# Altium project Headnode.PrjPcb
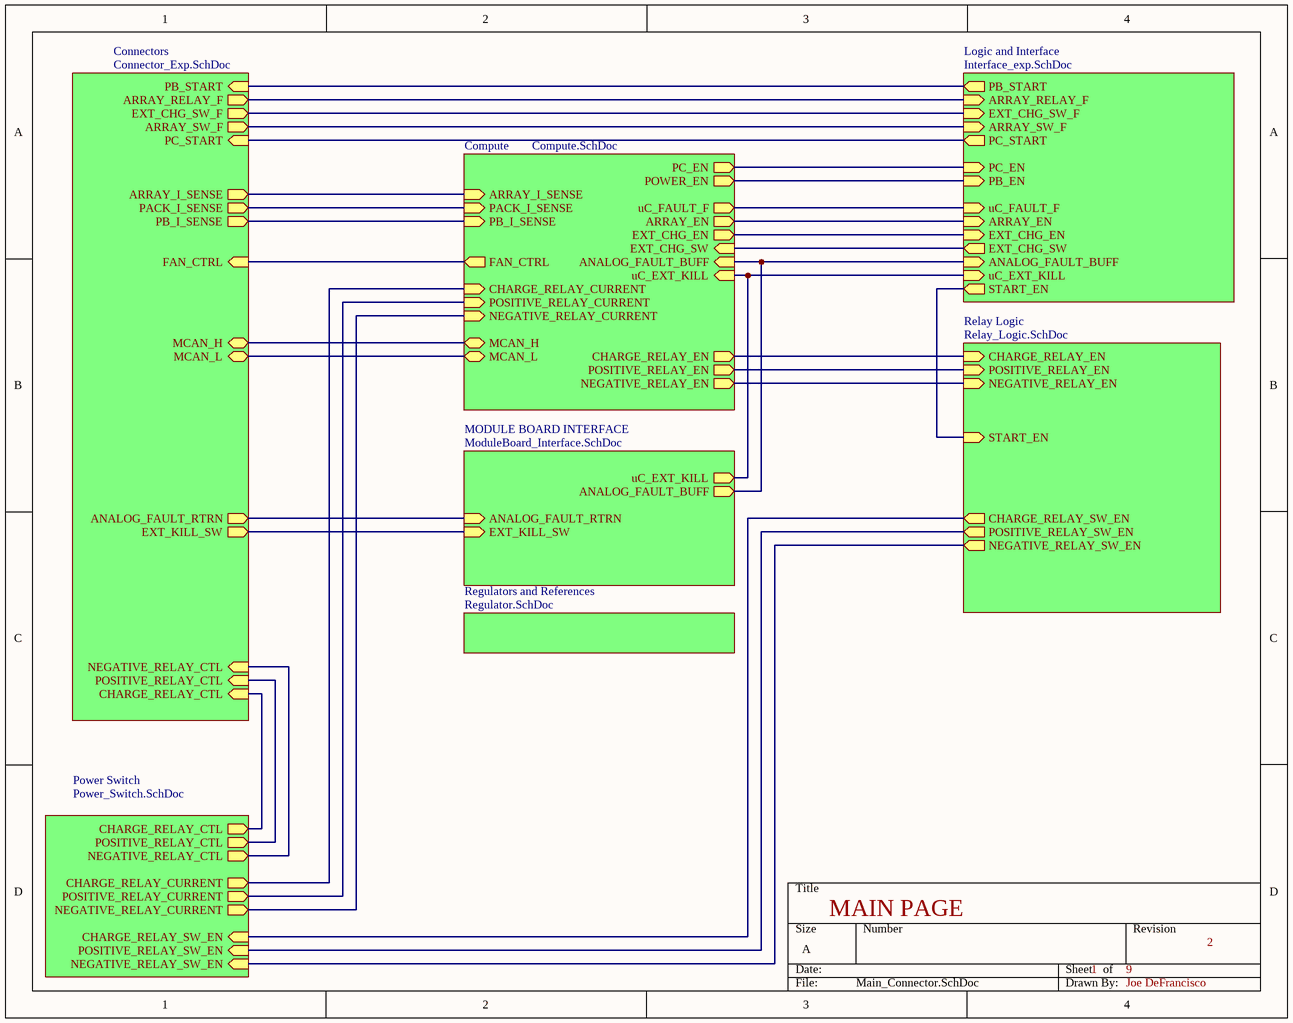
[diagram p0: Main_Connector.SchDoc]
8 sheets, 105 parts. Net scope: hierarchical (ports join the sheet entries above them; power ports are global).
Board file: Headnode.PcbDoc
Sheets:
  Main_Connector.SchDoc
    Compute = Compute.SchDoc
    Connectors = Connector_Exp.SchDoc
    Logic and Interface = Interface_exp.SchDoc
    MODULE BOARD INTERFACE = ModuleBoard_Interface.SchDoc
    Regulators and References = Regulator.SchDoc
    Power Switch = Power_Switch.SchDoc
    Relay Logic = Relay_Logic.SchDoc

## Sheet Main_Connector.SchDoc
size A; SheetNumber: 1; SheetTotal: 6

### Sub-sheets
Compute = Compute.SchDoc: ARRAY_I_SENSE (in), PACK_I_SENSE (in), PB_I_SENSE (in), FAN_CTRL (out), MCAN_H (bidir), MCAN_L (bidir), uC_EXT_KILL (in), EXT_CHG_SW (in), EXT_CHG_EN (out), uC_FAULT_F (out), ARRAY_EN (out), ANALOG_FAULT_BUFF (in), CHARGE_RELAY_EN (out), POSITIVE_RELAY_EN (out), NEGATIVE_RELAY_EN (out), PC_EN (out), POWER_EN (out), NEGATIVE_RELAY_CURRENT (in), POSITIVE_RELAY_CURRENT (in), CHARGE_RELAY_CURRENT (in)
Connectors = Connector_Exp.SchDoc: ARRAY_I_SENSE (out), PACK_I_SENSE (out), ARRAY_SW_F (out), EXT_CHG_SW_F (out), ARRAY_RELAY_F (out), PC_START (in), PB_I_SENSE (out), EXT_KILL_SW (out), ANALOG_FAULT_RTRN (out), MCAN_H (bidir), MCAN_L (bidir), FAN_CTRL (in), CHARGE_RELAY_CTL (in), POSITIVE_RELAY_CTL (in), NEGATIVE_RELAY_CTL (in), PB_START (in)
Logic and Interface = Interface_exp.SchDoc: PC_START (out), ARRAY_SW_F (in), EXT_CHG_SW_F (in), ARRAY_RELAY_F (in), uC_FAULT_F (in), ARRAY_EN (in), EXT_CHG_EN (in), EXT_CHG_SW (out), PC_EN (in), PB_EN (in), PB_START (out), uC_EXT_KILL (in), ANALOG_FAULT_BUFF (in), START_EN (out)
MODULE BOARD INTERFACE = ModuleBoard_Interface.SchDoc: ANALOG_FAULT_RTRN (in), ANALOG_FAULT_BUFF (out), uC_EXT_KILL (out), EXT_KILL_SW (in)
Power Switch = Power_Switch.SchDoc: CHARGE_RELAY_CTL (out), POSITIVE_RELAY_CTL (out), NEGATIVE_RELAY_CTL (out), CHARGE_RELAY_SW_EN (in), POSITIVE_RELAY_SW_EN (in), NEGATIVE_RELAY_SW_EN (in), CHARGE_RELAY_CURRENT (out), POSITIVE_RELAY_CURRENT (out), NEGATIVE_RELAY_CURRENT (out)
Regulators and References = Regulator.SchDoc: no entries
Relay Logic = Relay_Logic.SchDoc: CHARGE_RELAY_EN (in), POSITIVE_RELAY_EN (in), NEGATIVE_RELAY_EN (in), CHARGE_RELAY_SW_EN (out), POSITIVE_RELAY_SW_EN (out), NEGATIVE_RELAY_SW_EN (out), START_EN (in)

### Nets
EXT_CHG_SW: sheet Compute/EXT_CHG_SW, sheet Logic and Interface/EXT_CHG_SW
MCAN_H: sheet Compute/MCAN_H, sheet Connectors/MCAN_H
MCAN_L: sheet Compute/MCAN_L, sheet Connectors/MCAN_L
START_EN: sheet Logic and Interface/START_EN, sheet Relay Logic/START_EN
NetC4_1: sheet Compute/uC_EXT_KILL, sheet Connectors/EXT_KILL_SW, sheet Logic and Interface/uC_EXT_KILL, sheet MODULE BOARD INTERFACE/uC_EXT_KILL, sheet MODULE BOARD INTERFACE/EXT_KILL_SW
NetCH_LG_1: sheet Power Switch/CHARGE_RELAY_SW_EN, sheet Relay Logic/CHARGE_RELAY_SW_EN
NetCH_REL_EN_1: sheet Compute/CHARGE_RELAY_EN, sheet Relay Logic/CHARGE_RELAY_EN
NetD2_2: sheet Connectors/CHARGE_RELAY_CTL, sheet Power Switch/CHARGE_RELAY_CTL
NetD3_2: sheet Connectors/POSITIVE_RELAY_CTL, sheet Power Switch/POSITIVE_RELAY_CTL
NetD4_2: sheet Connectors/NEGATIVE_RELAY_CTL, sheet Power Switch/NEGATIVE_RELAY_CTL
NetJ7_3: sheet Compute/PACK_I_SENSE, sheet Connectors/PACK_I_SENSE
NetJ9_3: sheet Compute/ARRAY_I_SENSE, sheet Connectors/ARRAY_I_SENSE
NetJ10_1: sheet Connectors/PC_START, sheet Logic and Interface/PC_START
NetJ11_1: sheet Compute/PB_I_SENSE, sheet Connectors/PB_I_SENSE
NetJ12_3: sheet Compute/FAN_CTRL, sheet Connectors/FAN_CTRL
NetJ13_1: sheet Connectors/ANALOG_FAULT_RTRN, sheet MODULE BOARD INTERFACE/ANALOG_FAULT_RTRN
NetJ14_1: sheet Connectors/ARRAY_SW_F, sheet Logic and Interface/ARRAY_SW_F
NetJ14_2: sheet Connectors/EXT_CHG_SW_F, sheet Logic and Interface/EXT_CHG_SW_F
NetJ14_3: sheet Connectors/ARRAY_RELAY_F, sheet Logic and Interface/ARRAY_RELAY_F
NetJ17_1: sheet Connectors/PB_START, sheet Logic and Interface/PB_START
NetNEG_LOG_1: sheet Power Switch/NEGATIVE_RELAY_SW_EN, sheet Relay Logic/NEGATIVE_RELAY_SW_EN
NetNEG_REL_EN_1: sheet Compute/NEGATIVE_RELAY_EN, sheet Relay Logic/NEGATIVE_RELAY_EN
NetPOS_LG_1: sheet Power Switch/POSITIVE_RELAY_SW_EN, sheet Relay Logic/POSITIVE_RELAY_SW_EN
NetPOS_REL_EN_1: sheet Compute/POSITIVE_RELAY_EN, sheet Relay Logic/POSITIVE_RELAY_EN
NetQ4_1: sheet Compute/POWER_EN, sheet Logic and Interface/PB_EN
NetQ5_1: sheet Compute/PC_EN, sheet Logic and Interface/PC_EN
NetQ6_2: sheet Compute/ANALOG_FAULT_BUFF, sheet Logic and Interface/ANALOG_FAULT_BUFF, sheet MODULE BOARD INTERFACE/ANALOG_FAULT_BUFF
NetR1_1: sheet Compute/EXT_CHG_EN, sheet Logic and Interface/EXT_CHG_EN
NetR2_1: sheet Compute/ARRAY_EN, sheet Logic and Interface/ARRAY_EN
NetR5_1: sheet Compute/uC_FAULT_F, sheet Logic and Interface/uC_FAULT_F
NetR32_1: sheet Compute/CHARGE_RELAY_CURRENT, sheet Power Switch/CHARGE_RELAY_CURRENT
NetR35_1: sheet Compute/POSITIVE_RELAY_CURRENT, sheet Power Switch/POSITIVE_RELAY_CURRENT
NetR38_1: sheet Compute/NEGATIVE_RELAY_CURRENT, sheet Power Switch/NEGATIVE_RELAY_CURRENT

### Notes on the sheet
- MAIN PAGE
- 1
- 9
- 2
- Joe DeFrancisco

## Sheet Compute.SchDoc: Compute Module Interface
size A4; SheetNumber: 6; SheetTotal: 6; ImagePath: X:\solarcar\P15_BPS\P15_BPS\logo.jpg
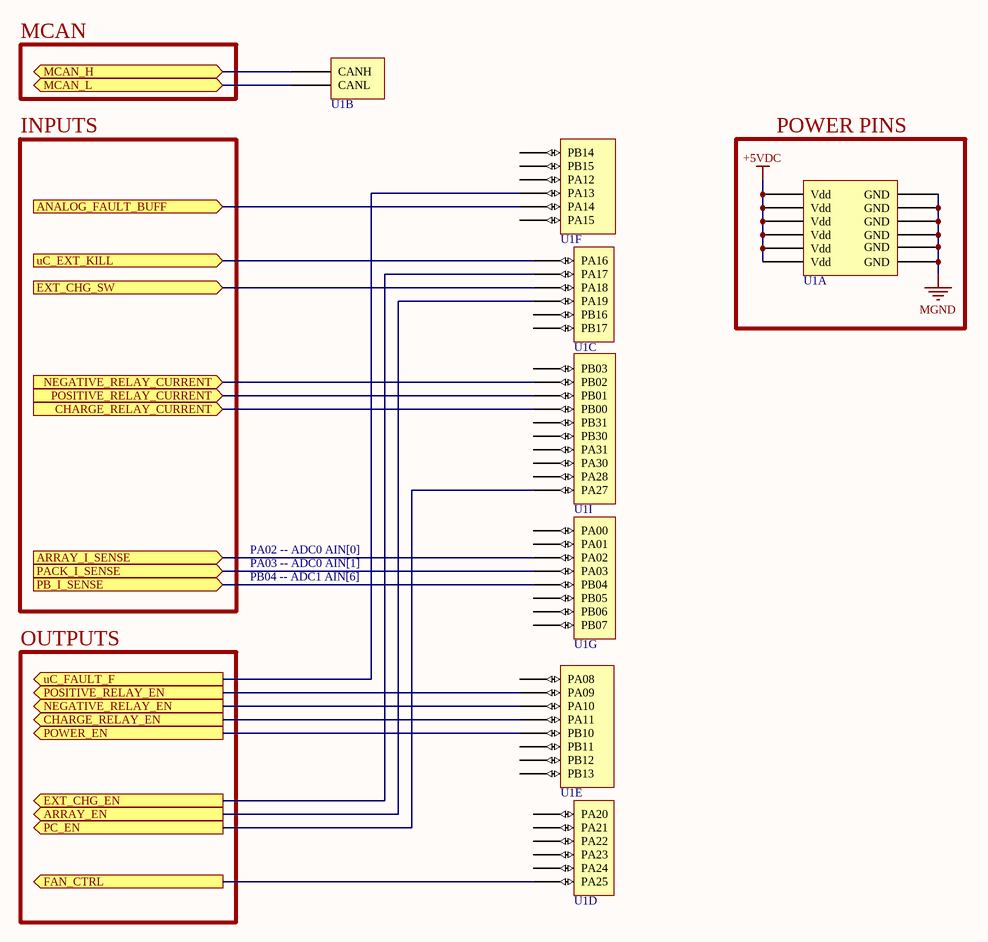
[diagram p1: Compute.SchDoc]

### Parts
U1  S+  [Compute S+]  (value not drawn)  (parts A,B,C,D,E,F,G,I of 9)

### Blocks framed on the sheet
POWER PINS: U1

### Ports
ANALOG_FAULT_BUFF (in), ARRAY_EN (out), ARRAY_I_SENSE (in), CHARGE_RELAY_CURRENT (in), CHARGE_RELAY_EN (out), EXT_CHG_EN (out), EXT_CHG_SW (in), FAN_CTRL (out), MCAN_H (bidir), MCAN_L (bidir), NEGATIVE_RELAY_CURRENT (in), NEGATIVE_RELAY_EN (out), PACK_I_SENSE (in), PB_I_SENSE (in), PC_EN (out), POSITIVE_RELAY_CURRENT (in), POSITIVE_RELAY_EN (out), POWER_EN (out), uC_EXT_KILL (in), uC_FAULT_F (out)

### Nets
+5VDC: U1.Vdd
MGND: U1.GND
EXT_CHG_SW: U1.PA18 ; port EXT_CHG_SW
MCAN_H: U1.CANH ; port MCAN_H
MCAN_L: U1.CANL ; port MCAN_L
NetC4_1: U1.PA16 ; port uC_EXT_KILL
NetCH_REL_EN_1: U1.PA11 ; port CHARGE_RELAY_EN
NetJ7_3: U1.PA03 ; port PACK_I_SENSE
NetJ9_3: U1.PA02 ; port ARRAY_I_SENSE
NetJ11_1: U1.PB04 ; port PB_I_SENSE
NetJ12_3: U1.PA25 ; port FAN_CTRL
NetNEG_REL_EN_1: U1.PA10 ; port NEGATIVE_RELAY_EN
NetPOS_REL_EN_1: U1.PA09 ; port POSITIVE_RELAY_EN
NetQ4_1: U1.PB10 ; port POWER_EN
NetQ5_1: U1.PA27 ; port PC_EN
NetQ6_2: U1.PA14 ; port ANALOG_FAULT_BUFF
NetR1_1: U1.PA17 ; port EXT_CHG_EN
NetR2_1: U1.PA19 ; port ARRAY_EN
NetR5_1: U1.PA13 ; port uC_FAULT_F
NetR32_1: U1.PB00 ; port CHARGE_RELAY_CURRENT
NetR35_1: U1.PB01 ; port POSITIVE_RELAY_CURRENT
NetR38_1: U1.PB02 ; port NEGATIVE_RELAY_CURRENT

Not connected (* = marked no-connect by the designer): U1 PA00 PA01 PA08 PA12 PA20 PA21 PA22 PA23 PA24 PA28 PA30 PA31 PB03 PB05 PB06 PB07 PB09(PA15) PB11 PB12 PB13 PB14 PB15 PB16 PB17 PB30 PB31

### Notes on the sheet
- MCAN
- INPUTS
- PA02 -- ADC0 AIN[0]
- PA03 -- ADC0 AIN[1]
- PB04 -- ADC1 AIN[6]
- OUTPUTS
- Title
- Size:
- Date:
- A4
- Number:
- Time:
- Revision:
- Sheet
- of
- File:

### Library data of the parts
U1 = S+: Need to get 4 of PPPC161LFBN-RC; Digi-key: https://www.digikey.com/product-detail/en/sullins-connector-solutions/PPPC161LFBN-RC/S7049-ND/810188; datasheet: https://media.digikey.com/pdf/Data%20Sheets/Sullins%20PDFs/Female_Headers.100_DS.pdf

## Sheet Connector_Exp.SchDoc: Connectors
size A3; Organization: PRISUM; Revision: 2; SheetNumber: 2; SheetTotal: 6
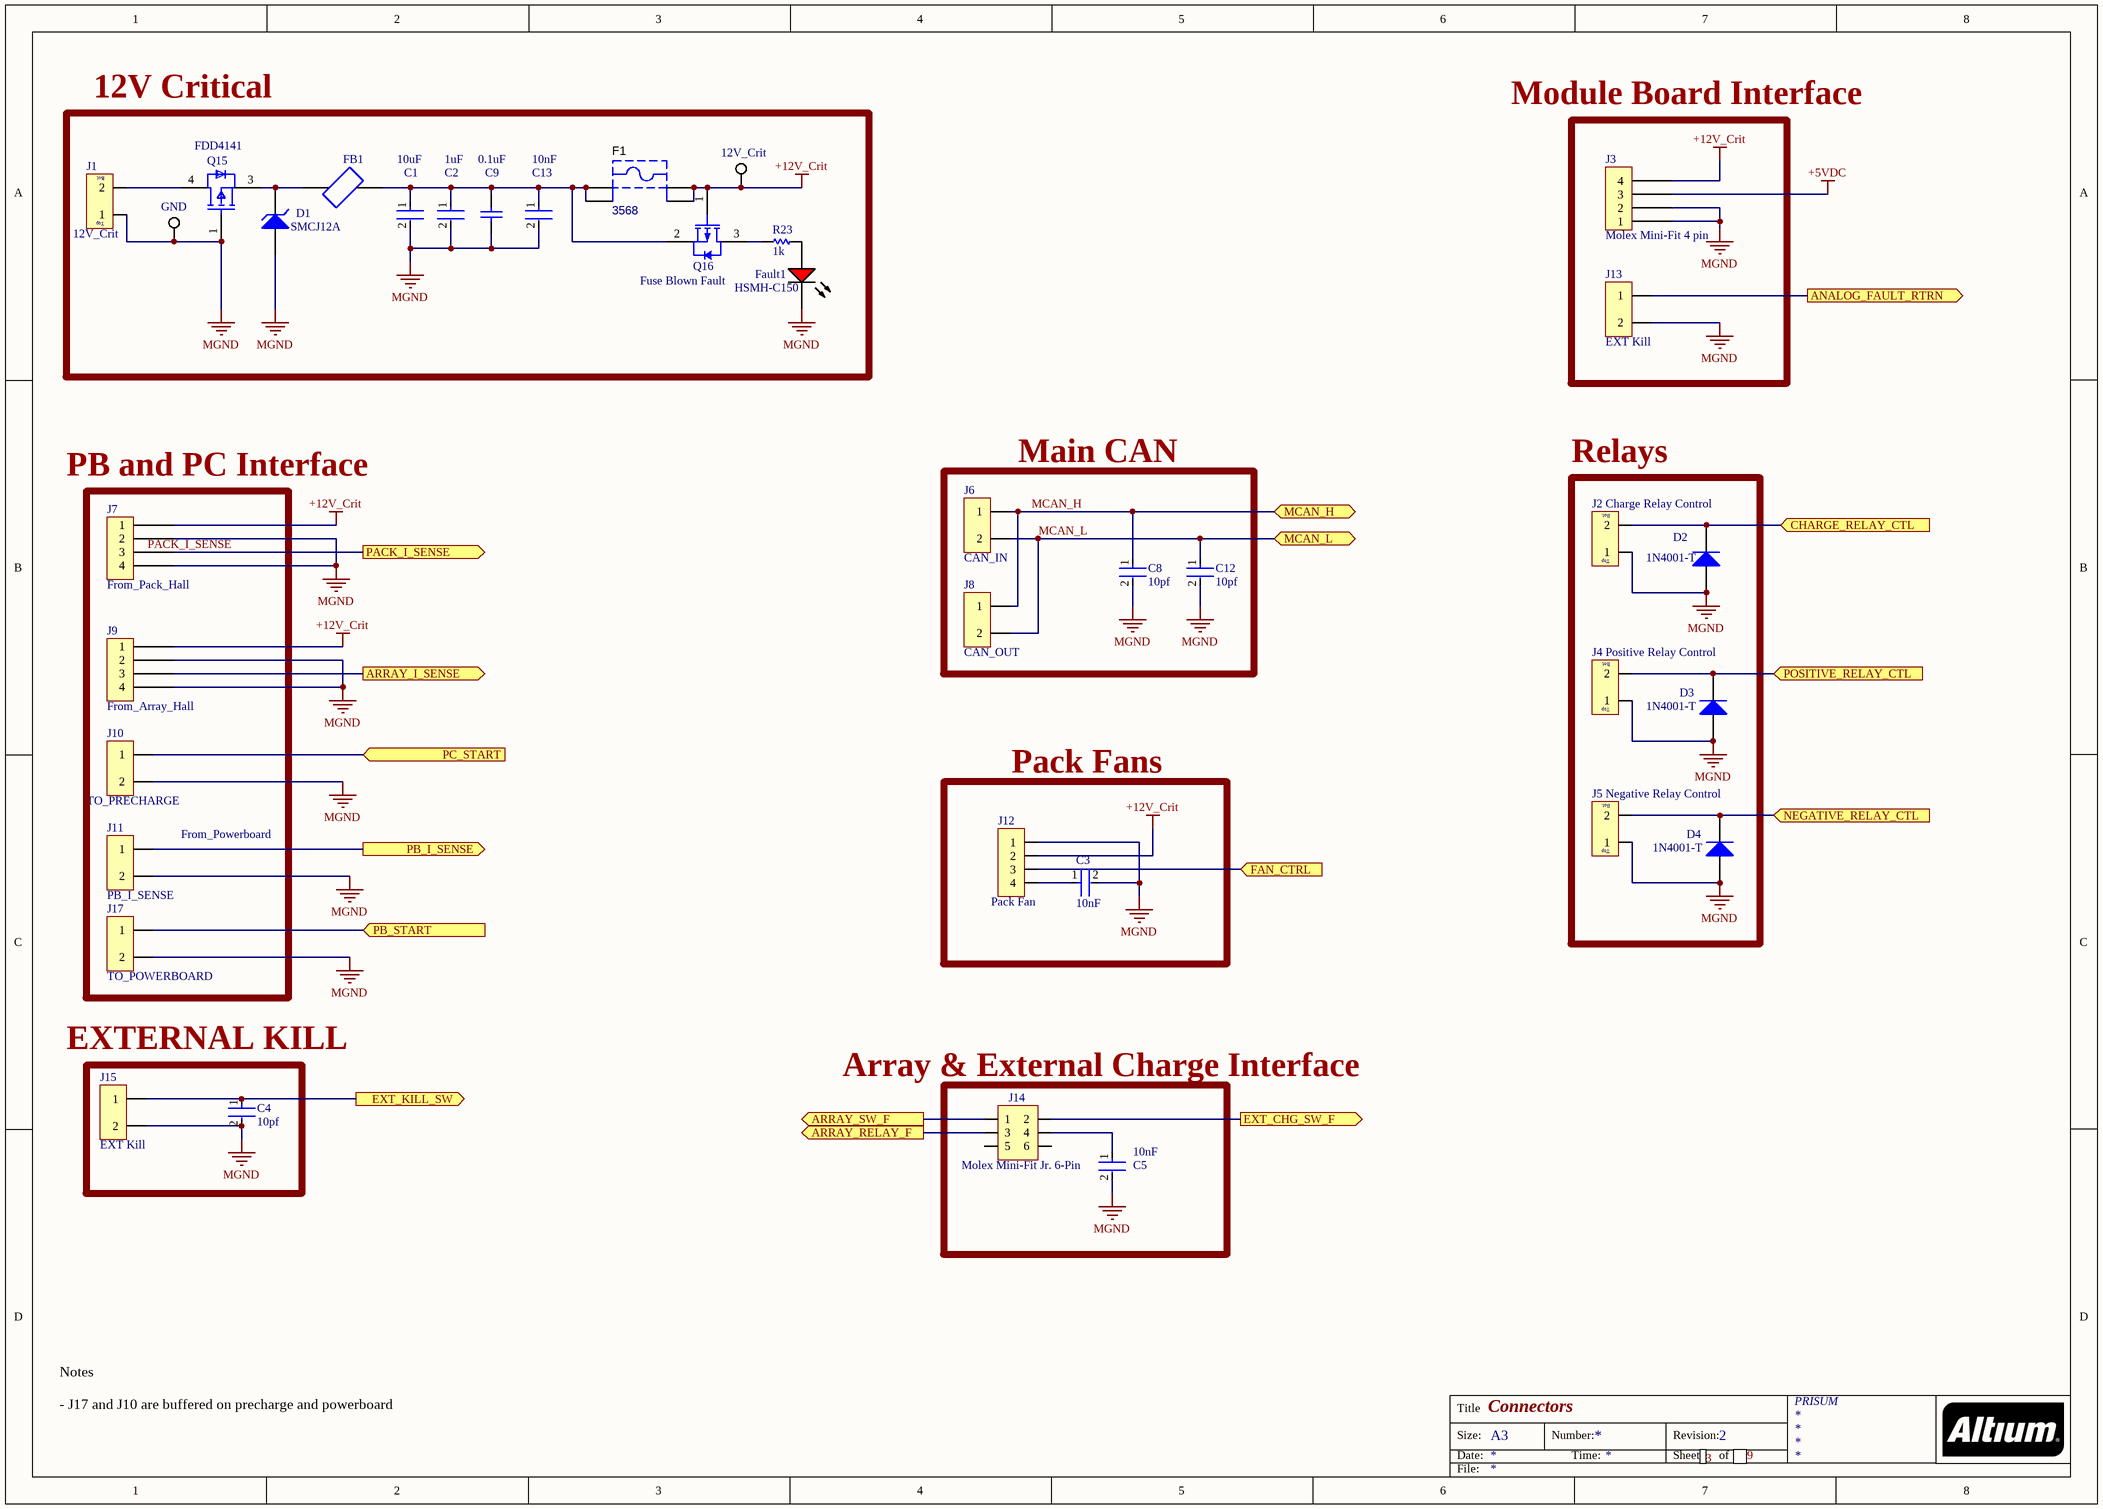
[diagram p2: Connector_Exp.SchDoc]

### Parts
12V_Crit  Test Point  [Test Point]  (value not drawn)
C1  Capacitance: 10uF  [FP-CL31-IPC_A]  (hidden comment: CL31A106MOHNNNE)
C2  Capacitance: 1uF  [FP-CL31-IPC_A]  (hidden comment: CL31F105ZOCNNNC)
C3  Capacitance: 10nF  [FP-CGA3E-0_3-0_1-IPC_A]  (hidden comment: CGA3E2X8R2A103K080AD)
C4  10pf  [FP-C0805C-DN-MFG]
C5  Capacitance: 10nF  [FP-CGA3E-0_3-0_1-IPC_A]  (hidden comment: CGA3E2X8R2A103K080AD)
C8  10pf  [FP-C0805C-DN-MFG]
C9  Capacitance: 0.1uF  [CAPC2013X94X50LL20T25]  (hidden comment: 08055C104JAT2A)
C12  10pf  [FP-C0805C-DN-MFG]
C13  Capacitance: 10nF  [FP-CGA3E-0_3-0_1-IPC_A]  (hidden comment: CGA3E2X8R2A103K080AD)
D1  SMCJ12A  [LFUS-DO-214AB-2_V]
D2  1N4001-T  [DIOD-DO-41-P-2_V]
D3  1N4001-T  [DIOD-DO-41-P-2_V]
D4  1N4001-T  [DIOD-DO-41-P-2_V]
F1  3568  [KSTN-3568_V]
Fault1  HSMH-C150  [AVAG-HSMX-C150_V]
FB1  HI1206N800R-10  [FB_HI1206N800R-10]  (value not drawn)
GND  Test Point  [Test Point]  (value not drawn)
J1  12V_Crit  [CONN_2P_MEGAFIT_HORIZONTAL]
J2  Charge Relay Control  [CONN_2P_MEGAFIT_HORIZONTAL]
J3  Molex Mini-Fit 4 pin  [Molex Mini-Fit Jr. 4-Pin - no flange]
J4  Positive Relay Control  [CONN_2P_MEGAFIT_HORIZONTAL]
J5  Negative Relay Control  [CONN_2P_MEGAFIT_HORIZONTAL]
J6  CAN_IN  [Mini-Fit Jr. 2]
J7  From_Pack_Hall  [Molex Mini-Fit Jr. 4-Pin - no flange]
J8  CAN_OUT  [Mini-Fit Jr. 2]
J9  From_Array_Hall  [Molex Mini-Fit Jr. 4-Pin - no flange]
J10  TO_PRECHARGE  [Mini-Fit Jr. 2]
J11  PB_I_SENSE  [Mini-Fit Jr. 2]
J12  Molex Mini-Fit Jr. 4-Pin no flange  [Molex Mini-Fit Jr. 4-Pin - no flange]  (value not drawn)
J13  EXT Kill  [Mini-Fit Jr. 2]
J14  Molex Mini-Fit Jr. 6-Pin  [Molex Mini-Fit Jr. 6-Pin]
J15  EXT Kill  [Mini-Fit Jr. 2]
J17  TO_POWERBOARD  [Mini-Fit Jr. 2]
Q15  FDD4141  [FP-369AS-MFG]
Q16  Fuse Blown Fault  [INTR-SOT-23-3_V]
R23  SchematicInformation: 1k  [R_0603]  (hidden comment: RES_1k_1%_0603)

### Blocks framed on the sheet
12V Critical: 12V_Crit C1 C2 C9 C13 D1 F1 Fault1 FB1 GND J1 Q15 Q16 R23
From_Powerboard: J7 J9-J11 J17
Main CAN: C8 C12 J6 J8
Relays: D2-D4 J2 J4 J5
Pack Fans: C3 J12

### Ports
ANALOG_FAULT_RTRN (out), ARRAY_I_SENSE (out), ARRAY_RELAY_F (out), ARRAY_SW_F (out), CHARGE_RELAY_CTL (in), EXT_CHG_SW_F (out), EXT_KILL_SW (out), FAN_CTRL (in), MCAN_H (bidir), MCAN_L (bidir), NEGATIVE_RELAY_CTL (in), PACK_I_SENSE (out), PB_I_SENSE (out), PB_START (in), PC_START (in), POSITIVE_RELAY_CTL (in)

### Nets
+5VDC: J3.3
+12V_Crit: 12V_Crit.1 F1.3 F1.4 J3.4 J7.1 J9.1 J12.2 Q16.1(GATE)
MGND: C1.2 C2.2 C3.2 C4.2 C5.2 C8.2 C9.1 C12.2 C13.2 D1.1(A) D2.1(A) D3.1(A) D4.1(A) Fault1.2(K) GND.1 J1.1 J2.1 J3.1 J3.2 J4.1 J5.1 J7.2 J7.4 J9.2 J9.4 J10.2 J11.2 J12.1 J13.2 J15.2 J17.2 Q15.1(G)
MCAN_H: C8.1 J6.1 J8.1 ; port MCAN_H
MCAN_L: C12.1 J6.2 J8.2 ; port MCAN_L
NetC1_1: C1.1 C2.1 C9.2 C13.1 F1.1 F1.2 FB1.2 Q16.2(SOURCE)
NetC3_1: C3.1 J12.4
NetC4_1: C4.1 J15.1 ; port EXT_KILL_SW
NetC5_1: C5.1 J14.4
NetD1_2: D1.2(K) FB1.1 Q15.3(S)
NetD2_2: D2.2(K) J2.2 ; port CHARGE_RELAY_CTL
NetD3_2: D3.2(K) J4.2 ; port POSITIVE_RELAY_CTL
NetD4_2: D4.2(K) J5.2 ; port NEGATIVE_RELAY_CTL
NetFault1_1: Fault1.1(A) R23.2
NetJ1_2: J1.2 Q15.4(D)
NetJ7_3: J7.3 ; port PACK_I_SENSE
NetJ9_3: J9.3 ; port ARRAY_I_SENSE
NetJ10_1: J10.1 ; port PC_START
NetJ11_1: J11.1 ; port PB_I_SENSE
NetJ12_3: J12.3 ; port FAN_CTRL
NetJ13_1: J13.1 ; port ANALOG_FAULT_RTRN
NetJ14_1: J14.1 ; port ARRAY_SW_F
NetJ14_2: J14.2 ; port EXT_CHG_SW_F
NetJ14_3: J14.3 ; port ARRAY_RELAY_F
NetJ17_1: J17.1 ; port PB_START
NetQ16_3: Q16.3(DRAIN) R23.1

Not connected (* = marked no-connect by the designer): J14 5 6

### Notes on the sheet
- Module Board Interface
- (near J7) PB and PC Interface
- (near J12) Pack Fan
- EXTERNAL KILL
- (near J14) Array & External Charge Interface
- Notes
  - J17 and J10 are buffered on precharge and powerboard
- 3
- 9
- Labels drawn without touching a wire or pin: PACK_I_SENSE
- Title
- Size:
- Date:
- A3
- Number:
- Time:
- Revision:
- Sheet
- of
- File:
- (in symbol CONN_2P_MEGAFIT_HORIZONTAL) Bot.; Top

### Library data of the parts
C1 = CMP-13271-002453-1: Cap Ceramic 10uF 16V X5R ±20% SMD 1206 +85°C Embossed T/R; Thickness: 0.071inch; Case Code (Imperial): 1206; Case Code (Metric): 3216; Height: 1.6mm; Max Operating Temperature: 85°C; Voltage Rating: 16V; Package Quantity: 1; Length: 3.2mm; Dielectric: X5R; Voltage Rating (DC): 16V; Tolerance: 20%; Case/Package: 1206; Depth: 1.6mm; Mount: Surface Mount; Radiation Hardening: No; Width: 0.063inch; Lead Free: Lead Free; Min Operating Temperature: -55°C; Packaging: Tape and Reel
C2 = CMP-13271-003959-1: Cap Ceramic 1uF 16V Y5V -20/+80% SMD 1206 +85°C Embossed T/R; Tolerance: 80%; Length: 3.2mm; Package Quantity: 4000; Lead Free: Lead Free; Height: 0.85mm; Packaging: Tape and Reel; Max Operating Temperature: 85°C; Case Code (Imperial): 1206; Case/Package: 1206; Dielectric: Y5V; Min Operating Temperature: -30°C; Voltage Rating (DC): 16V; Width: 0.063inch; Mount: Surface Mount; Voltage Rating: 16V; Depth: 1.6mm; Thickness: 0.039inch; Radiation Hardening: No; Case Code (Metric): 3216
C3 C5 C13 = CMP-08246-000769-1: Cap Ceramic 10nF 100V X8R 10% Pad SMD 0603 +150°C Automotive T/R; Mount: Surface Mount; Voltage Rating (DC): 100V; Termination: SMD/SMT; Dielectric: X8R; Case/Package: 0603; Ratings: AEC-Q200; Voltage Rating: 100V; Packaging: Tape and Reel; Thickness: 0.035inch; Composition: Ceramic; Max Operating Temperature: 150°C; Width: 0.031inch; Height: 0.8mm; Weight: 7.1E-05oz; Depth: 0.8mm; Min Operating Temperature: -55°C; Length: 1.6mm; Case Code (Metric): 1608; Tolerance: 10%; Package Quantity: 4000; Case Code (Imperial): 0603
C4 C8 C12 = CMP-03020-001866-1: C0805 10 pF C0G 30ppm/°C 2.00% 50 V; Manufacturer Part Number: C0805C100G5GACTU; Manufacturer: KEMET; Tolerance: 0.02; Voltage Rating: 50 V; Material: Ceramic; Device Class L1: Passive Components; Category: Cap; Temperature: -55°C to +125°C; Height: 0.88mm; Ipc Land Pattern Name: CAPC200125X78; ComponentLink2URL: https://content.kemet.com/datasheets/KEM_C1003_C0G_SMD.pdf; Capacitance: 10 pF; Octopart: https://octopart.com/c0805c100g5gactu-kemet-20071675; Device Class L2: Capacitors; Device Class L3: Ceramic Capacitors; Temperature Range Low: -55°C; RoHS: TRUE; Temperature Range High: +125°C; Temperature Characteristic: C0G; Value: 10 pF; Mouser Description: Multilayer Ceramic Capacitors MLCC - SMD/SMT 50volts 10pF C0G 2%; ComponentLink2Description: Datasheet; Package: C0805C-DN; Lead Free: Yes; Automotive: No; Temperature Coefficient: 30ppm/°C
C9 = CMP-2000-05808-1: Chip Capacitor, 0.1 uF, +/- 5%, 50 V, -55 to 125 degC, 0805 (2012 Metric), RoHS, Tape and Reel; Case Width: 1.25mm; Case Length: 2.01mm; Case Height: 0.94mm; Brand: AVX; Type: StandardX7RMLCCs; Capacitance - nF: 100nF; Dissipation Factor DF: 2.5; Voltage Rating DC: 50V; Temperature Coefficient / Code: +/-15%; Capacitance - pF: 100000pF; Dielectric: X7R; Dimensions: 1.25mmWx2.01mmLx0.94mmH; Product: GeneralTypeMLCCs; Package Description: 2-Pin Surface Mount Device, Body 2.01 x 1.25 mm; Package / Case: 0805(2012metric); Product Category: MultilayerCeramicCapacitorsMLCC-SMD/SMT; Case Code - mm: 2012; Packaging: Reel; Manufacturer URL: http://www.avx.com/; Operating Temperature Range: -55Cto+125C; Termination Style: SMD/SMT; Maximum Operating Temperature: +125C; Case Code - in: 0805; Minimum Operating Temperature: -55C; Factory Pack Quantity: 4000; RoHS: Details; Voltage Rating: 50V; Tolerance: 5%; Package Reference: 0805; Datasheet URL: http://www.farnell.com/datasheets/1679506.pdf; Manufacturer: AVX; Mounting Technology: SurfaceMount; Datasheet Version: 11/2012
D1 = CMP-2000-07101-1: Transient Voltage Suppression Diode, 12 V, -65 to 150 degC, 2-Pin DO-214AB (SMCJ), RoHS, Tape and Reel; Manufacturer: Littelfuse; Directional: Uni-Directional; Breakdown Voltage-Max: 14.7V; Clamping Voltage-Max: 19.9V; Breakdown Voltage-Min: 13.3V; Power Dissipation: 1500W; Manufacturer URL: http://www.littelfuse.com/; Datasheet Version: 11/2015; Package Description: 2-Pin Surface Mount Device, Body 6.855 x 5.905 mm; Package Reference: DO-214AB; Mounting Technology: SurfaceMount; Datasheet URL: http://www.littelfuse.com/products/tvs-diodes/surface-mount/~/media/electronics/datasheets/tvs_diodes/littelfuse_tvs_diode_smcj_datasheet.pdf.pdf; ComponentLink1Description: Datasheet; ComponentLink1URL: https://www.littelfuse.com/products/tvs-diodes/surface-mount/~/media/electronics/datasheets/tvs_diodes/littelfuse_tvs_diode_smcj_datasheet.pdf.pdf; ComponentLink2Description: Digikey; ComponentLink2URL: https://www.digikey.com/product-detail/en/SMCJ12A/SMCJ12ALFCT-ND/762588?utm_campaign=buynow&WT.z_cid=ref_octopart_dkc_buynow&utm_medium=aggregator&curr=usd&site=us&utm_source=octopart
D2-D4 = CMP-0639-00006-2: 1.0 A Rectifier, 15 pF, 50 V, -65 to 150 degC, 2-Pin DO-41 Plastic, RoHS, Tape and Reel; Manufacturer: Diodes Inc; VF (V): 1; CT (pF): 15; Max. IR (uA): 5; VRRM (V): 50; Max. IFSM (A): 30; RoHS: TRUE; Mounting Technology: Through Hole; PartNumber: 1N4001-T; ComponentLink2Description: Datasheet; DatasheetVersion: Rev. 8-2; Operating Temperature Range (degC): -65 to 150; Packing: Tape and Reel; PackageReference: DO-41-P-2; ComponentLink1URL: http://diodes.com/; PackageDescription: 2-Pin Axial Lead, Body 4.635 x 2.36 mm, Lead Spread 25.4 mm; ComponentLink2URL: http://diodes.com/datasheets/ds28002.pdf; Max. Average Rectified Current IO (A): 1; ComponentLink1Description: Manufacturer URL
F1 = CMP-2000-05464-1: Fuse Holder, 20 A, 500 V, -50 to 145 degC, 4-Pin THD, RoHS; Manufacturer: Keystone; Package Reference: 3568; Datasheet Version: 04/2013; Datasheet URL: https://datasheet.ciiva.com/16294/m60-2p40-16294706.pdf; Manufacturer URL: http://www.keyelco.com/; Mounting Technology: ThroughHole; Package Description: 4-Pin Through Hole Device, Body 16 x 6.73 mm, Pitch 9.9 mm
Fault1 = CMP-2000-06426-1: LED Uni-Color Red, 65 mW, 25 mA, -40 to 85 degC, 2-Pin SMD, RoHS, Tape and Reel; Manufacturer: Avago; Product Height (mm): 1.1mm; Power Dissipation: 78W; Product Length (mm): 3.2mm; Forward Voltage: 2.6V; Luminous Intensity: 17mcd; DELETED: Compliant; Shape Type: Rectangular; Peak Wavelength: 660nm; Main Category: ChipLED; Dominant Wave Length: 639nm; Rad Hardened: No; Lens Type: ColorlessDiffused; Product Depth (mm): 1.6mm; Reverse Voltage: 5V; Forward Current: 25mA; Chip Material: GaAlAs; Test Current (It): 20mA; Viewing Angle: 170deg; Number of  Elements: 1; Type: Uni-Color; Package Reference: HSMX-C150; Package Description: 2-Pin Surface Mount Device, Body 3.2 x 1.6 mm; Operating Temp Range: -40Cto85C; Mounting: SurfaceMount; Emitting Color: Red; Pin Count: 2; Operating Temperature Classification: Industrial; Datasheet URL: http://media.digikey.com/pdf/Data%20Sheets/Avago%20PDFs/HSMz-Czzz.pdf; Package Type: ChipLed; Mounting Technology: SurfaceMount; High Brightness: No; Lens Dimensions: 2x1.6x0.6mm; Manufacturer URL: http://www.avagotech.com/; Lum Intensity: 17mcd; Datasheet Version: 03/2012; Packaging: TapeandReel
FB1 = HI1206N800R-10: 80 Ohms @ 100MHz 1 Power, Signal Line Ferrite Bead 1206 (3216 Metric) 3A 35mOhm; MF: Laird-Signal Integrity; SnapEDA_Link: https://www.snapeda.com/parts/HI1206N800R-10/Laird-Signal%20Integrity%20Products/view-part/296889/?ref=snap; Purchase-URL: https://pricing.snapeda.com/search/part/HI1206N800R-10/?ref=eda; Check_prices: https://www.snapeda.com/parts/HI1206N800R-10/Laird-Signal%20Integrity%20Products/view-part/296889/?ref=eda; Value: *; Digi-Key_Part_Number: 240-2409-1-ND; Package: 1206 Laird-Signal Integrity; MP: HI1206N800R-10
J1 J2 J4 J5 = CONN_2P_MEGAFIT_HORIZONTAL: *; Manufacturer Part Number: 0768250002; Manufacturer: Molex; SchematicInformation: MegaFit_2P; DigiKey Part Number: WM11969-ND
J6 J8 J10 J11 J13 J15 J17 = Mini-Fit Jr. 2-pin: Mini-Fit Jr. 2-pin Right Angle; Manufacturer: Molex Inc; Manufacturer Part Number: 0039300020; Connector Type: Header, Shrouded; Number of Positions: 2; Number of Positions Loaded: All; Row Spacing: 0.165" (4.20mm); Ordering: http://search.digikey.com/scripts/DkSearch/dksus.dll?Detail&name=WM1351-ND; Datasheet: http://www.molex.com/pdm_docs/sd/039301020_sd.pdf; Supplier 1: Digi-Key; RoHS: RoHS Compliant; Category: Connectors, Interconnects; Stock 1: 371; Pricing 1: 1=0.77, 10=0.674, 50=0.6078, 100=0.5815, 250=0.5286, 500=0.47574, 1000=0.42288, 2500=0.38324, 5000=0.37002 (USD); Contact Type: Male Pin; Pitch: -; Number of Rows: 2; Contact Mating Length: -; Mounting Type: Through Hole, Right Angle; Termination: Solder; Fastening Type: Locking Ramp; Features: Board Lock; Contact Finish: Tin; Contact Finish Thickness: 200µin (5.08µm); Color: Natural; Packaging: Tray; ComponentLink1URL: http://www.molex.com/pdm_docs/sd/039300020_sd.pdf; ComponentLink1Description: http://www.molex.com/pdm_docs/sd/039300020_sd.pdf
  J6 J8 J11 J13 J15 J17: Supplier Part Number 1: WM21351-ND
J7 J9 = Molex Mini-Fit 4 pin
J12 = Molex Mini-Fit Jr. 4-Pin: 4-Pin Molex Mini-Fit Jr. Header; Manufacturer Part Number: 0039301040; Connector Type: Header, Shrouded; Number of Positions: 4; Number of Positions Loaded: All; Pitch: 0.165" (4.20mm); Drawn By: Aaron Mills; Drawing Date: Jan. 2, 2011; Manufacturer: Molex; ComponentLink1URL: http://www.molex.com/pdm_docs/sd/039295043_sd.pdf; ComponentLink1Description: Datasheet; Supplier1: http://search.digikey.com/us/en/products/39-30-1040/WM1352-ND/561079; Supplier 1: Digi-Key; RoHS: RoHS Compliant; Category: Connectors, Interconnects; Stock 1: 4191; Pricing 1: 1=0.77, 10=0.674, 25=0.6344, 50=0.6078, 100=0.5815, 250=0.5286, 500=0.47574, 1000=0.42288, 2500=0.38324 (USD); Contact Type: Male Pin; Number of Rows: 2; Row Spacing: 0.165" (4.20mm); Contact Mating Length: -; Mounting Type: Through Hole, Right Angle; Termination: Solder; Fastening Type: Locking Ramp; Features: Board Lock; Contact Finish: Tin; Contact Finish Thickness: 100µin (2.54µm); Color: Natural; Packaging: Tray; ComponentLink2URL: http://www.molex.com/pdm_docs/sd/039301040_sd.pdf; ComponentLink2Description: http://www.molex.com/pdm_docs/sd/039301040_sd.pdf; Supplier Part Number 1: WM1352-ND
J14 = Molex Mini-Fit Jr. 6-Pin: 6-Pin Molex Mini-Fit Jr. Header  through hole; Drawn By: Aaron Mills; Drawing Date: Jan. 2, 2011; Manufacturer: Molex; ComponentLink1URL: http://www.molex.com/pdm_docs/sd/039295063_sd.pdf; ComponentLink1Description: Datasheet; ComponentLink2Description: Mechanical Drawing; Supplier 1: http://search.digikey.com/scripts/DkSearch/dksus.dll?Detail&name=WM3922-ND
Q15 = CMP-07173-000088-1: MOSFET P-CH 40V 10.8A DPAK; Manufacturer: ON Semiconductor; Gate Charge At Vgs: 36nC @ -10V; Transconductance: 38S; Drain To Source Breakdown Voltage: -40V; Reverse Recovery Time: 29ns; Pulse Drain Current: -100A; Reverse Recovery Charge: 26nC; Drain To Source Resistance: 10.1mΩ; Power Dissipation: 2.4W; Max Forward Diode Voltage: -1.2V; Turn Off Delay Time: 38ns; Number Of P Channels: 1; Gate To Source Voltage: 20V; Rthja Max: 52°C/W; Depletion Mode: False; Threshold Vgs Max: -3V; Threshold Vgs Min: -1V; Turn On Delay Time: 10ns; Max Junction Temp: +150°C; Input Capacitace At Vds: 2085pF @ -20V; Continuous Drain Current: -10.8A; Typ Forward Diode Voltage: -0.8V; Package: 369AS; Category: Diode; RoHS: TRUE; Device Class L2: Transistors; Octopart: https://octopart.com/fdd4141-on+semiconductor-84325802; Temperature: -55°C to +150°C; Drain To Source Voltage: -40V; Device Class L1: Discrete Semiconductors; Temperature Range Low: -55°C; Height: 2.517mm; ComponentLink2Description: Datasheet; Automotive: No; Number Of Channels: 1; Digikey Description: MOSFET P-CH 40V 10.8A DPAK; Lead Free: Yes; Manufacturer Part Number: FDD4141; Temperature Range High: +150°C; Footprint Url: https://www.onsemi.com/pub/Collateral/369AS.PDF; Device Class L3: MOSFETs; Mouser Description: MOSFET -40V P-Channel PowerTrench; ComponentLink2URL: https://www.onsemi.com/pub/Collateral/FDD4141-D.pdf
Q16 = CMP-2000-04987-1: HEXFET(R) Power P-Channel MOSFET, -20 V, -3.7 A, -55 to 150 degC, 3-Pin SOT-23, RoHS, Tape and Reel; Manufacturer: International Rectifier; Drain-to-Source Voltage [Vdss]: 20V; Rated Power Dissipation: 1.3W; Qg Gate Charge: 8nC; Drain-Source On Resistance-Max: 0.065O; Channel Type: P-Channel; Package Reference: SOT-23-3; Manufacturer URL: http://internationalrectifier.com/; Datasheet URL: http://datasheet.octopart.com/IRLML6402TRPBF-International-Rectifier-datasheet-93882.pdf; Datasheet Version: Feb-05; Package Description: 3-Pin Small Outline Transistor, Body 2.92 x 1.3 mm, Pitch 0.95 mm
R23 = RES_1k_1%_0603: Manufacturer Part Number: RC0603FR-071KL; Manufacturer: Yageo; DigiKey Part Number: 311-1.00KHRCT-ND

## Sheet Interface_exp.SchDoc: Array and Charger Interface
size A; SheetNumber: 3; SheetTotal: 6
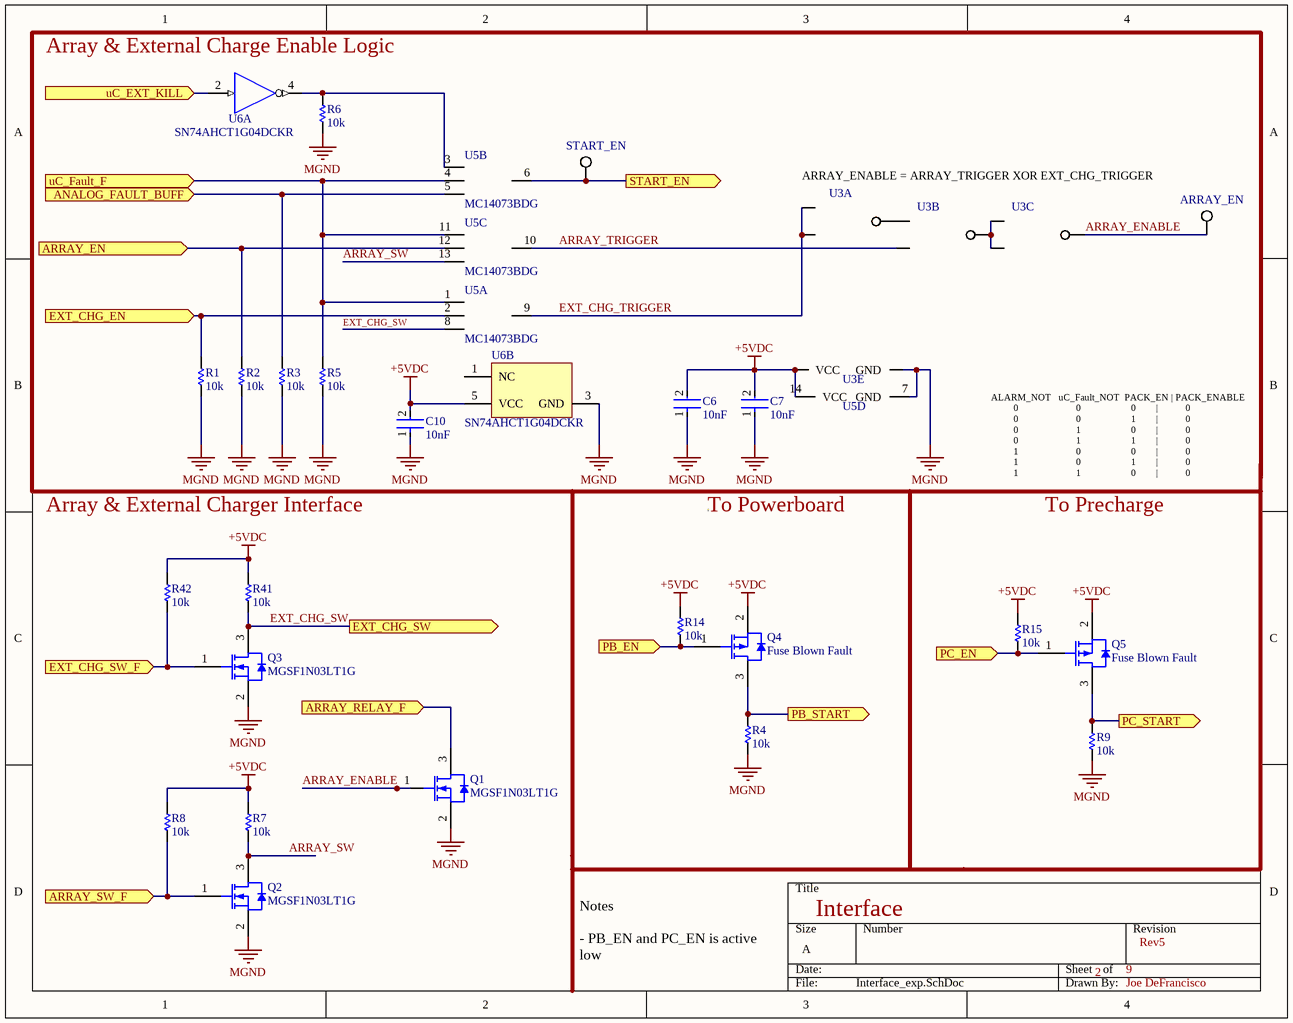
[diagram p3: Interface_exp.SchDoc]

### Parts
ARRAY_EN  Test Point  [Test Point]  (value not drawn)
C6  Capacitance: 10nF  [FP-CGA3E-0_3-0_1-IPC_A]  (hidden comment: CGA3E2X8R2A103K080AD)
C7  Capacitance: 10nF  [FP-CGA3E-0_3-0_1-IPC_A]  (hidden comment: CGA3E2X8R2A103K080AD)
C10  Capacitance: 10nF  [FP-CGA3E-0_3-0_1-IPC_A]  (hidden comment: CGA3E2X8R2A103K080AD)
Q1  MGSF1N03LT1G  [ONSC-SOT-23-3-318-08_V]
Q2  MGSF1N03LT1G  [ONSC-SOT-23-3-318-08_V]
Q3  MGSF1N03LT1G  [ONSC-SOT-23-3-318-08_V]
Q4  Fuse Blown Fault  [INTR-SOT-23-3_V]
Q5  Fuse Blown Fault  [INTR-SOT-23-3_V]
R1  SchematicInformation: 10k  [R_0603]  (hidden comment: RES_10k_1%_0603)
R2  SchematicInformation: 10k  [R_0603]  (hidden comment: RES_10k_1%_0603)
R3  SchematicInformation: 10k  [R_0603]  (hidden comment: RES_10k_1%_0603)
R4  SchematicInformation: 10k  [R_0603]  (hidden comment: RES_10k_1%_0603)
R5  SchematicInformation: 10k  [R_0603]  (hidden comment: RES_10k_1%_0603)
R6  SchematicInformation: 10k  [R_0603]  (hidden comment: RES_10k_1%_0603)
R7  SchematicInformation: 10k  [R_0603]  (hidden comment: RES_10k_1%_0603)
R8  SchematicInformation: 10k  [R_0603]  (hidden comment: RES_10k_1%_0603)
R9  SchematicInformation: 10k  [R_0603]  (hidden comment: RES_10k_1%_0603)
R14  SchematicInformation: 10k  [R_0603]  (hidden comment: RES_10k_1%_0603)
R15  SchematicInformation: 10k  [R_0603]  (hidden comment: RES_10k_1%_0603)
R41  SchematicInformation: 10k  [R_0603]  (hidden comment: RES_10k_1%_0603)
R42  SchematicInformation: 10k  [R_0603]  (hidden comment: RES_10k_1%_0603)
START_EN  Test Point  [Test Point]  (value not drawn)
U3  Quad NAND Gate - 2 Input  [SO14]  (value not drawn)  (parts A,B,C,E of 5)
U5  MC14073BDG  [SO14]  (parts A,B,C,D of 4)
U6  SN74AHCT1G04DCKR  [DCK0005A_L]  (parts A,B of 2)

### Ports
ANALOG_FAULT_BUFF (in), ARRAY_EN (in), ARRAY_RELAY_F (in), ARRAY_SW_F (in), EXT_CHG_EN (in), EXT_CHG_SW (out), EXT_CHG_SW_F (in), PB_EN (in), PB_START (out), PC_EN (in), PC_START (out), START_EN (out), uC_EXT_KILL (in), uC_Fault_F (in)

### Nets
+5VDC: C6.2 C7.2 C10.2 Q4.2(SOURCE) Q5.2(SOURCE) R7.1 R8.1 R14.1 R15.1 R41.1 R42.1 U3.14(VCC) U5.14(VCC) U6.5(VCC)
MGND: C6.1 C7.1 C10.1 Q1.2(S) Q2.2(S) Q3.2(S) R1.2 R2.2 R3.2 R4.2 R5.2 R6.2 R9.2 U3.7(GND) U5.7(GND) U6.3(GND)
ARRAY_ENABLE: ARRAY_EN.1 Q1.1(G) U3.8
ARRAY_SW: Q2.3(D) R7.2 U5.13
ARRAY_TRIGGER: U3.5 U5.10
EXT_CHG_SW: Q3.3(D) R41.2 U5.8 ; port EXT_CHG_SW
EXT_CHG_TRIGGER: U3.1 U3.2 U5.9
START_EN: START_EN.1 U5.6 ; port START_EN
NetC4_1: U6.2(A) ; port uC_EXT_KILL
NetJ10_1: Q5.3(DRAIN) R9.1 ; port PC_START
NetJ14_1: Q2.1(G) R8.2 ; port ARRAY_SW_F
NetJ14_2: Q3.1(G) R42.2 ; port EXT_CHG_SW_F
NetJ14_3: Q1.3(D) ; port ARRAY_RELAY_F
NetJ17_1: Q4.3(DRAIN) R4.1 ; port PB_START
NetQ4_1: Q4.1(GATE) R14.2 ; port PB_EN
NetQ5_1: Q5.1(GATE) R15.2 ; port PC_EN
NetQ6_2: R3.1 U5.5 ; port ANALOG_FAULT_BUFF
NetR1_1: R1.1 U5.2 ; port EXT_CHG_EN
NetR2_1: R2.1 U5.12 ; port ARRAY_EN
NetR5_1: R5.1 U5.1 U5.4 U5.11 ; port uC_Fault_F
NetR6_1: R6.1 U5.3 U6.4(Y)
NetU3_3: U3.3 U3.4
NetU3_6: U3.6 U3.9 U3.10

Not connected (* = marked no-connect by the designer): U6 1(NC)

### Notes on the sheet
- Array & External Charge Enable Logic
- (near U3) ARRAY_ENABLE = ARRAY_TRIGGER XOR EXT_CHG_TRIGGER
- ALARM_NOT   uC_Fault_NOT  PACK_EN | PACK_ENABLE
  0                       0                    0        |           0
  0                       0                    1        |           0
  0                       1                    0        |           0
  0                       1                    1        |           0
  1                       0                    0        |           0
  1                       0                    1        |           0
  1                       1                    0        |           0
  1                       1                    1        |           1
- Array & External Charger Interface
- To Powerboard
- To Precharge
- Interface
- 2
- 9
- Rev5
- Notes
  - PB_EN and PC_EN is active low
- Joe DeFrancisco

### Library data of the parts
C6 C7 C10 = CMP-08246-000769-1: as C3 on sheet Connector_Exp; Mount: Surface Mount; Voltage Rating (DC): 100V; Termination: SMD/SMT; Dielectric: X8R; Case/Package: 0603; Ratings: AEC-Q200; Voltage Rating: 100V; Packaging: Tape and Reel; Thickness: 0.035inch; Composition: Ceramic; Max Operating Temperature: 150°C; Width: 0.031inch; Height: 0.8mm; Weight: 7.1E-05oz; Depth: 0.8mm; Min Operating Temperature: -55°C; Length: 1.6mm; Case Code (Metric): 1608; Tolerance: 10%; Package Quantity: 4000; Case Code (Imperial): 0603
Q1-Q3 = CMP-1058-00778-1: Power MOSFET, 30 V, 2.1 A, Single N-Channel, 3-Pin SOT-23, Pb-Free, Tape and Reel; Manufacturer: On Semiconductor; VGS(th) Max (V): 2.4; Channel Polarity: N Channel; Ciss Typ (pF): 140; Crss Typ (pF): 40; Coss Typ (pF): 100; V(BR)DSS Min (V): 30; ID Max (A): 2.1; VGS Max (V): 20; ComponentLink1Description: Manufacturer URL; PartNumber: MGSF1N03LT1G; Packing: Tape and Reel; DatasheetVersion: Rev. 10; ComponentLink1URL: http://www.onsemi.com/; Mounting Technology: Surface Mount; PackageVersion: Rev. AP, 11/2009; PackageDescription: 3-Pin Small Outline Transistor, Body 2.92 x 1.3 mm, Pitch 0.95 mm; Package Type: SOT-23-3; ComponentLink3URL: http://www.onsemi.cn/pub_link/Collateral/318-08.PDF; RoHS: Pb-Free; ComponentLink3Description: Package Specification; ComponentLink2Description: Datasheet; Configuration: Single; PackageReference: SOT-23-3-318-08; ComponentLink2URL: http://www.onsemi.cn/pub_link/Collateral/MGSF1N03LT1-D.PDF
Q4 Q5 = CMP-2000-04987-1: as Q16 on sheet Connector_Exp; Channel Type: P-Channel; Package Reference: SOT-23-3; Manufacturer URL: http://internationalrectifier.com/; Datasheet URL: http://datasheet.octopart.com/IRLML6402TRPBF-International-Rectifier-datasheet-93882.pdf; Datasheet Version: Feb-05; Package Description: 3-Pin Small Outline Transistor, Body 2.92 x 1.3 mm, Pitch 0.95 mm
R1-R9 R14 R15 R41 R42 = RES_10k_1%_0603: Manufacturer Part Number: RC0603FR-0710KL; Manufacturer: Yageo; DigiKey Part Number: 311-10.0KHRCT-ND
U3 = NAND Quad 2 Input - 74AC00SCX: Quad NAND Gate - 2 Input 74AC00SCX; Digikey: http://www.digikey.com/product-detail/en/fairchild-semiconductor/74AC00SCX/74AC00SCXCT-ND/1626130; Datasheet: https://www.fairchildsemi.com/datasheets/74/74ACT00.pdf; Supplier 1: Digikey; Supplier Part Number 1: 74AC00SCXCT-ND
U5 = MC14073BDG: Triple 3-Input AND; ComponentLink1Description: Datasheet; ComponentLink1URL: http://www.onsemi.com/pub_link/Collateral/MC14001B-D.PDF; Drawn By: Aaron Mills; Drawing Date: Jan. 17, 2011
U6 = CMP-0859-00358-3: Single Inverter Gate, DCK0005A, LARGE T&R; Manufacturer: Texas Instruments; VCC(Min)(V): 2; Rating: Catalog; tpd @ Nom Voltage(Max)(ns): 7.5; F @ Nom Voltage(Max)(Mhz): 75; Schmitt Trigger: No; Output Type: CMOS; Logic: Inverting; VCC(Max)(V): 5.5; Sub-Family: Inverting Buffer/Driver; Bits(#): 1; Technology Family: AHCT; Voltage(Nom)(V): 5; Output Drive (IOL/IOH)(Max)(mA): 8/-8; ICC @ Nom Voltage(Max)(mA): 0.01; Input Type: CMOS; DatasheetVersion: SCLS319P; Operating Temperature Range(C): -40 to 125; Generic Part Number: SN74AHCT1G04; PackageReference: DCK0005A; 3-State Output: No

## Sheet ModuleBoard_Interface.SchDoc: Module Board Interface
size B; SheetNumber: 4; SheetTotal: 6
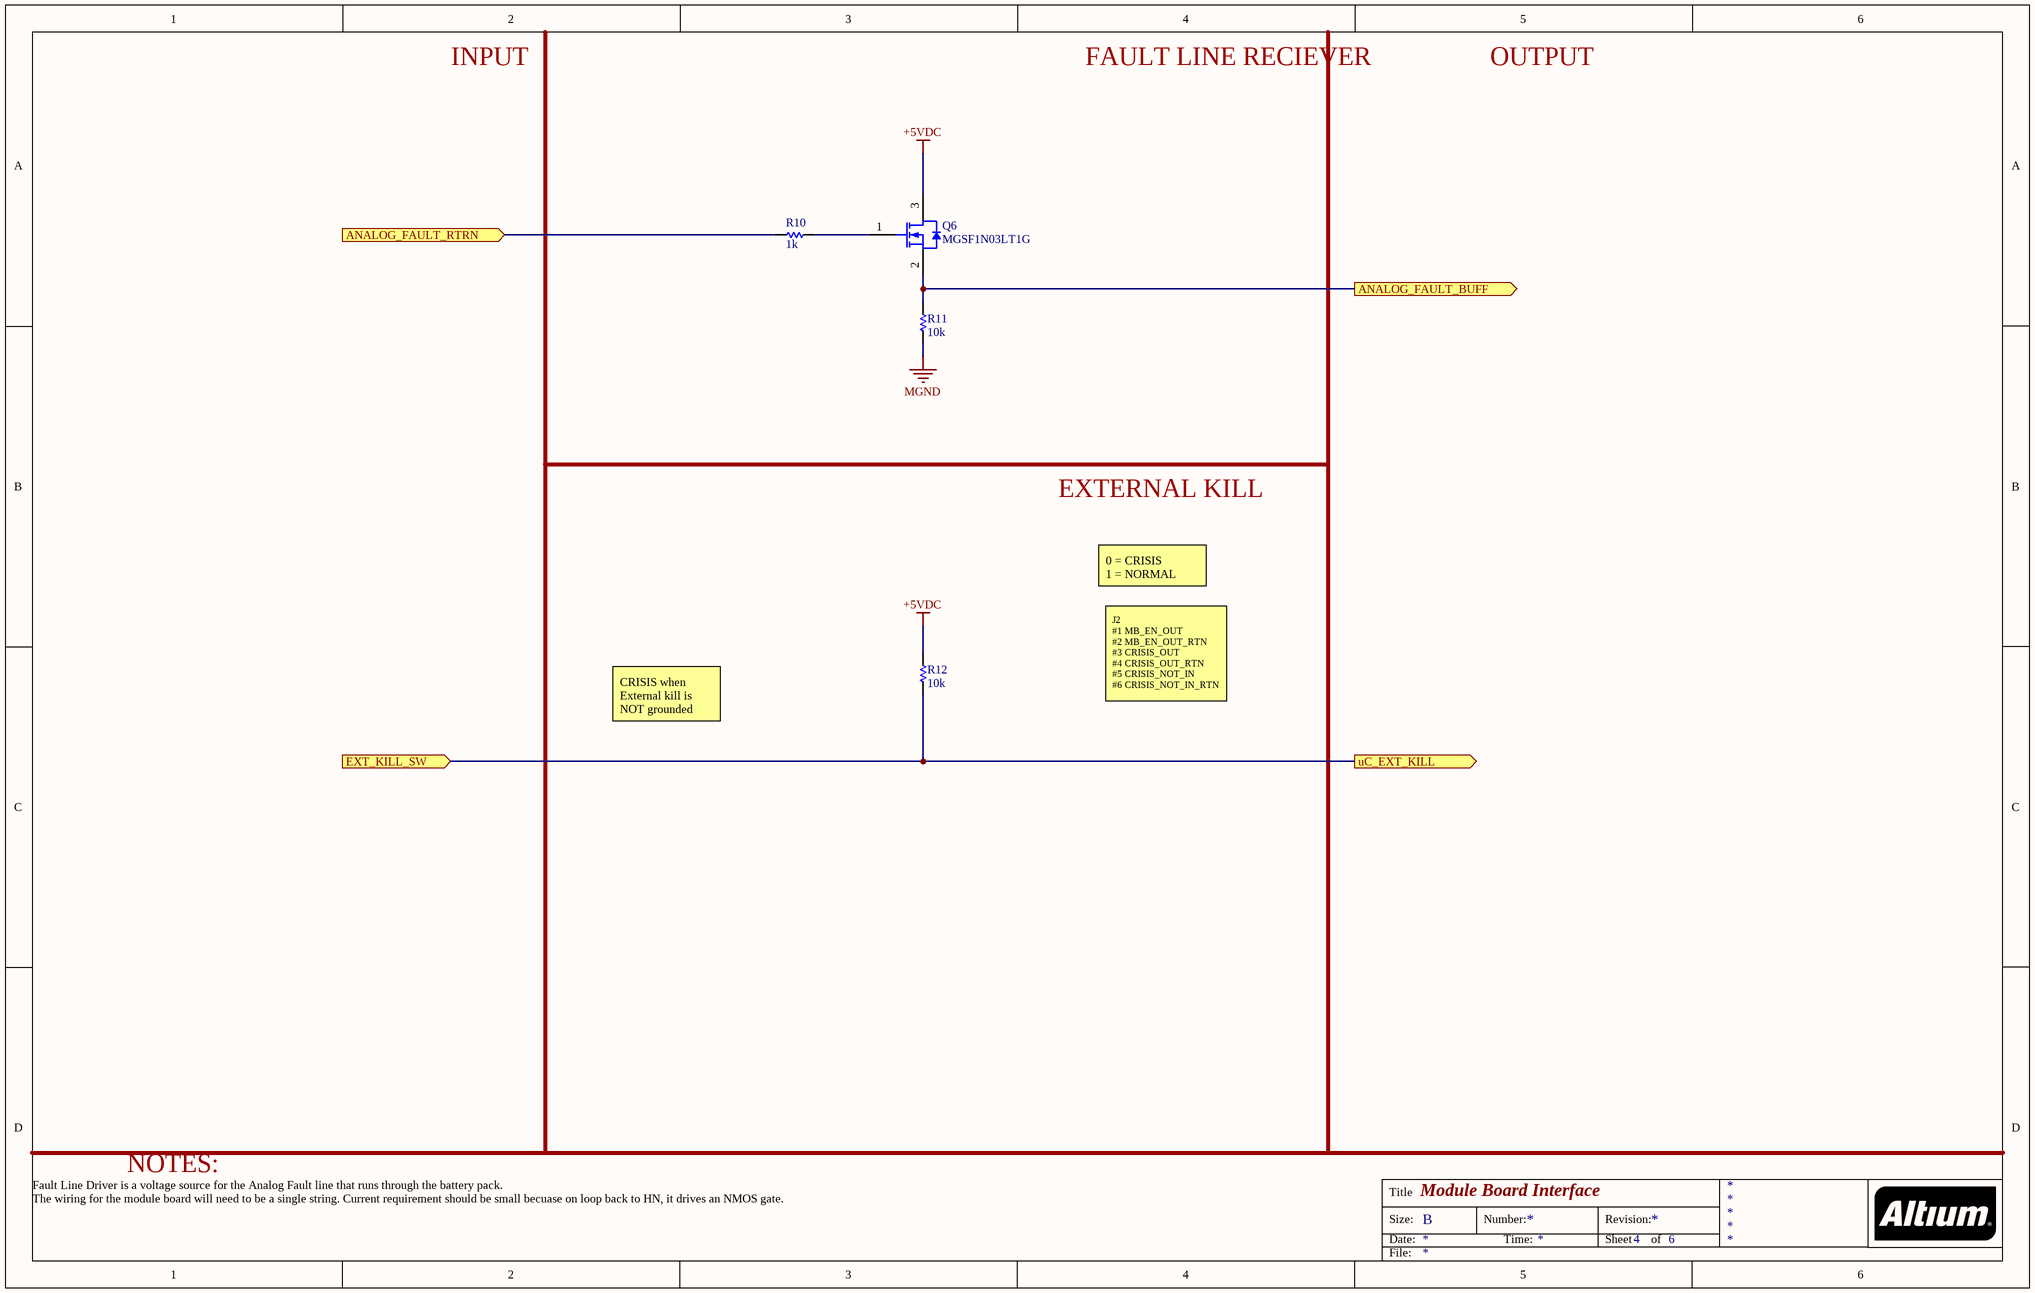
[diagram p4: ModuleBoard_Interface.SchDoc]

### Parts
Q6  MGSF1N03LT1G  [ONSC-SOT-23-3-318-08_V]
R10  SchematicInformation: 1k  [R_0603]  (hidden comment: RES_1k_1%_0603)
R11  SchematicInformation: 10k  [R_0603]  (hidden comment: RES_10k_1%_0603)
R12  SchematicInformation: 10k  [R_0603]  (hidden comment: RES_10k_1%_0603)

### Ports
ANALOG_FAULT_BUFF (out), ANALOG_FAULT_RTRN (in), EXT_KILL_SW (in), uC_EXT_KILL (out)

### Nets
+5VDC: Q6.3(D) R12.2
MGND: R11.1
NetC4_1: R12.1 ; port EXT_KILL_SW, port uC_EXT_KILL
NetJ13_1: R10.1 ; port ANALOG_FAULT_RTRN
NetQ6_1: Q6.1(G) R10.2
NetQ6_2: Q6.2(S) R11.2 ; port ANALOG_FAULT_BUFF

### Notes on the sheet
- INPUT
- FAULT LINE RECIEVER
- OUTPUT
- EXTERNAL KILL
- 0 = CRISIS
  1 = NORMAL
- J2
  #1 MB_EN_OUT
  #2 MB_EN_OUT_RTN
  #3 CRISIS_OUT
  #4 CRISIS_OUT_RTN
  #5 CRISIS_NOT_IN
  #6 CRISIS_NOT_IN_RTN
- CRISIS when External kill is NOT grounded
- NOTES:
- Fault Line Driver is a voltage source for the Analog Fault line that runs through the battery pack.
- The wiring for the module board will need to be a single string. Current requirement should be small becuase on loop back to HN, it drives an NMOS gate.
- Title
- Size:
- Date:
- B
- Number:
- Time:
- Revision:
- Sheet
- of
- File:

### Library data of the parts
Q6 = CMP-1058-00778-1: as Q1 on sheet Interface_exp; ComponentLink1Description: Manufacturer URL; PartNumber: MGSF1N03LT1G; Packing: Tape and Reel; DatasheetVersion: Rev. 10; ComponentLink1URL: http://www.onsemi.com/; Mounting Technology: Surface Mount; PackageVersion: Rev. AP, 11/2009; PackageDescription: 3-Pin Small Outline Transistor, Body 2.92 x 1.3 mm, Pitch 0.95 mm; Package Type: SOT-23-3; ComponentLink3URL: http://www.onsemi.cn/pub_link/Collateral/318-08.PDF; RoHS: Pb-Free; ComponentLink3Description: Package Specification; ComponentLink2Description: Datasheet; Configuration: Single; PackageReference: SOT-23-3-318-08; ComponentLink2URL: http://www.onsemi.cn/pub_link/Collateral/MGSF1N03LT1-D.PDF
R10 = RES_1k_1%_0603: as R23 on sheet Connector_Exp; DigiKey Part Number: 311-1.00KHRCT-ND
R11 R12 = RES_10k_1%_0603: as R1 on sheet Interface_exp; DigiKey Part Number: 311-10.0KHRCT-ND

## Sheet Regulator.SchDoc
size A; SheetNumber: 5; SheetTotal: 6
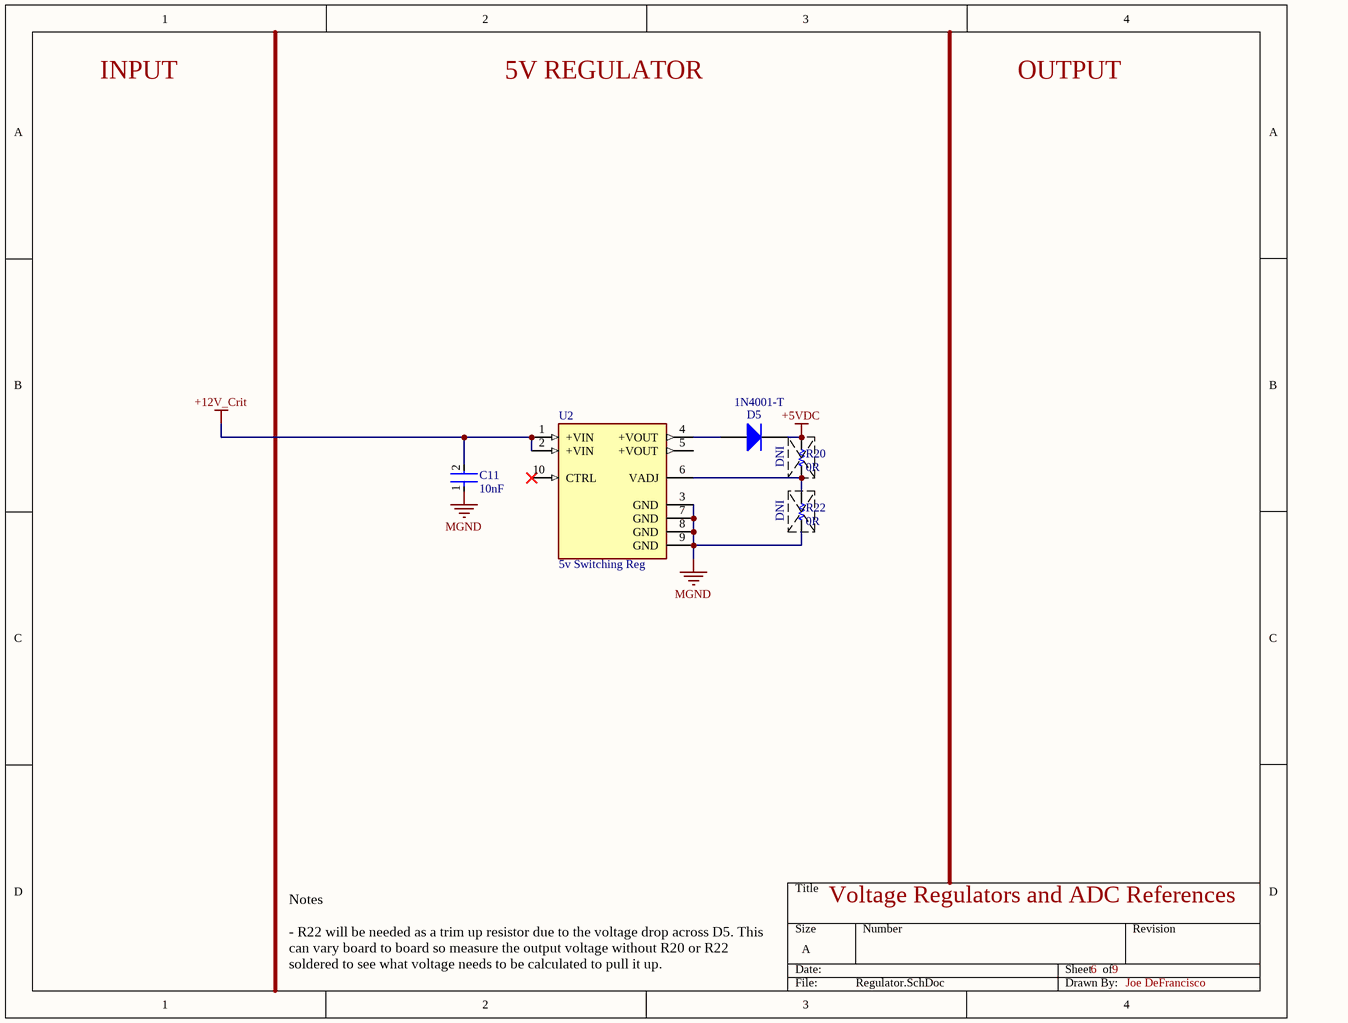
[diagram p5: Regulator.SchDoc]

### Parts
(Parts that share a designator on the sheet are numbered #1, #2 ... from top to bottom, then left to right.)
C11  Capacitance: 10nF  [FP-CGA3E-0_3-0_1-IPC_A]  (hidden comment: CGA3E2X8R2A103K080AD)
D5  1N4001-T  [DIOD-DO-41-P-2_V]
DNI??#1  DO NOT INSTALL  (value not drawn)  (graphical)
DNI??#2  DO NOT INSTALL  (value not drawn)  (graphical)
R20  SchematicInformation: 0R  [R_0603]  (hidden comment: RES_0R_1%_0603)
R22  SchematicInformation: 0R  [R_0603]  (hidden comment: RES_0R_1%_0603)
U2  5v Switching Reg  [5v Reg]

### Nets
+5VDC: D5.2(K) R20.2
+12V_Crit: C11.2 U2.1(+VIN) U2.2(+VIN)
MGND: C11.1 R22.1 U2.3(GND) U2.7(GND) U2.8(GND) U2.9(GND)
NetD5_1: D5.1(A) U2.4(+VOUT)
NetR20_1: R20.1 R22.2 U2.6(VADJ)

Not connected (* = marked no-connect by the designer): U2 5(+VOUT) 10(CTRL)*

### Notes on the sheet
- INPUT
- 5V REGULATOR
- OUTPUT
- Voltage Regulators and ADC References
- Notes
  - R22 will be needed as a trim up resistor due to the voltage drop across D5. This can vary board to board so measure the output voltage without R20 or R22 soldered to see what voltage needs to be calculated to pull it up.
- 6
- 9
- Joe DeFrancisco

### Library data of the parts
C11 = CMP-08246-000769-1: as C3 on sheet Connector_Exp; Mount: Surface Mount; Voltage Rating (DC): 100V; Termination: SMD/SMT; Dielectric: X8R; Case/Package: 0603; Ratings: AEC-Q200; Voltage Rating: 100V; Packaging: Tape and Reel; Thickness: 0.035inch; Composition: Ceramic; Max Operating Temperature: 150°C; Width: 0.031inch; Height: 0.8mm; Weight: 7.1E-05oz; Depth: 0.8mm; Min Operating Temperature: -55°C; Length: 1.6mm; Case Code (Metric): 1608; Tolerance: 10%; Package Quantity: 4000; Case Code (Imperial): 0603
D5 = CMP-0639-00006-2: as D2 on sheet Connector_Exp; RoHS: TRUE; Mounting Technology: Through Hole; PartNumber: 1N4001-T; ComponentLink2Description: Datasheet; DatasheetVersion: Rev. 8-2; Operating Temperature Range (degC): -65 to 150; Packing: Tape and Reel; PackageReference: DO-41-P-2; ComponentLink1URL: http://diodes.com/; PackageDescription: 2-Pin Axial Lead, Body 4.635 x 2.36 mm, Lead Spread 25.4 mm; ComponentLink2URL: http://diodes.com/datasheets/ds28002.pdf; Max. Average Rectified Current IO (A): 1; ComponentLink1Description: Manufacturer URL
DNI??#1 DNI??#2 = DNI
R20 R22 = RES_0R_1%_0603: Manufacturer Part Number: RC0603FR-070RL; Manufacturer: Yageo; DigiKey Part Number: 311-0.0HRCT-ND
U2 = 5v Switching Reg: 1A DC/DC-Converter 'INNOLINE' SMD reg; MF: Recom Power; MP: R-78AA5.0-1.0SMD-R; Value: *; Package: SMD-10 Recom Power; DigiKey-Purchase-URL: https://snapeda.com/shop?store=DigiKey&id=480105; SnapEDA_Link: https://www.snapeda.com/parts/R-78AA5.0-1.0SMD-R/Recom%20Power/view-part/480105/?ref=snap; Mouser-Purchase-URL: https://snapeda.com/shop?store=Mouser&id=480105; Digi-Key_Part_Number: 945-1044-1-ND; BuyPart: https://www.snapeda.com/parts/R-78AA5.0-1.0SMD-R/Recom%20Power/view-part/480105/?ref=eda; DigiKey: 945-1044-2-ND

## Sheet Power_Switch.SchDoc
size A
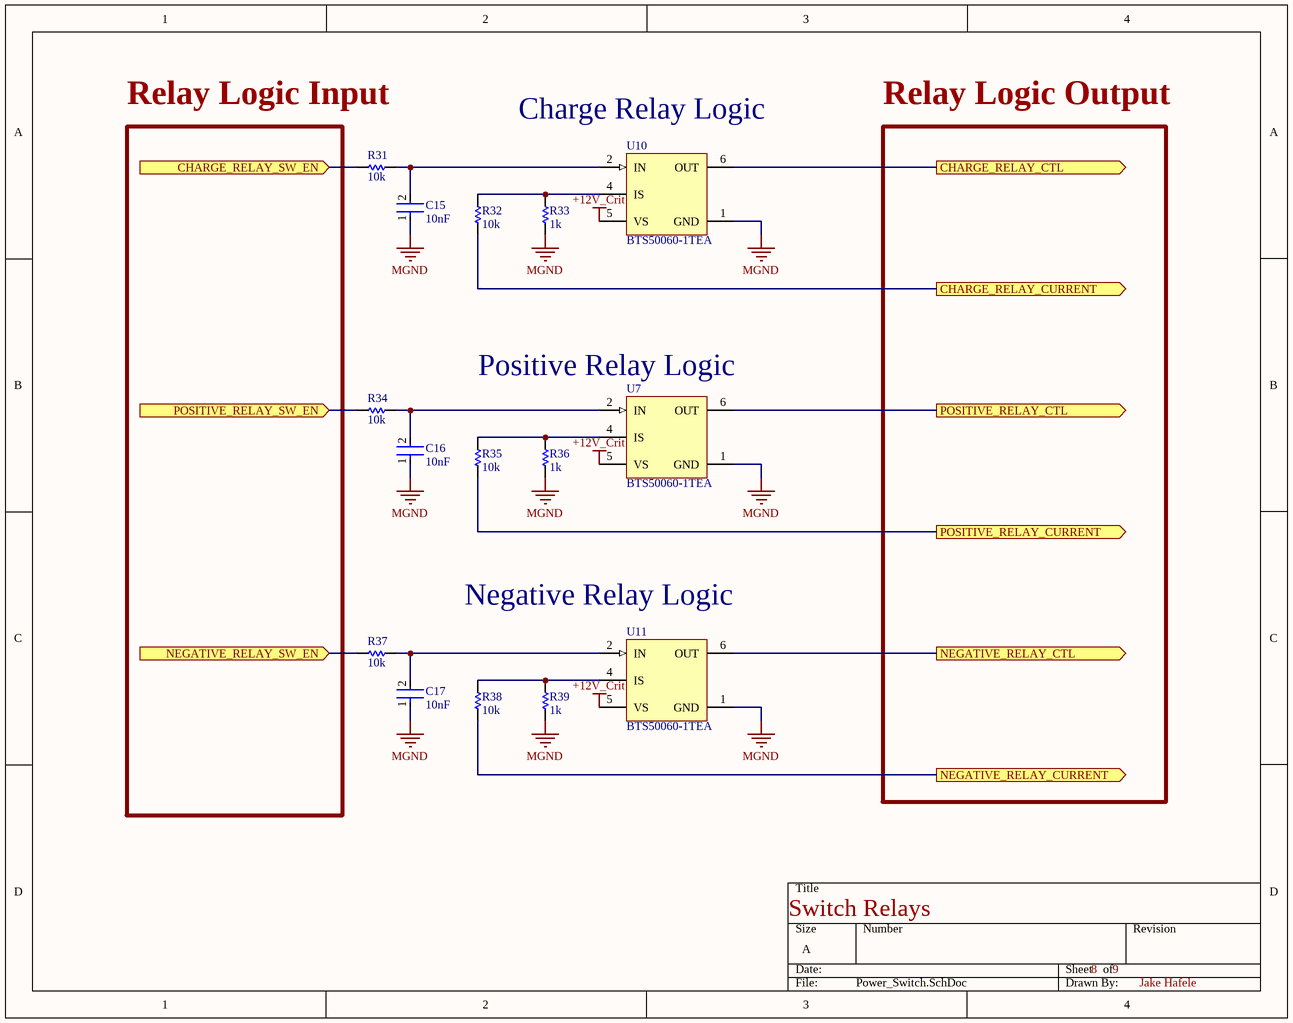
[diagram p6: Power_Switch.SchDoc]

### Parts
C15  Capacitance: 10nF  [FP-CGA3E-0_3-0_1-IPC_A]  (hidden comment: CGA3E2X8R2A103K080AD)
C16  Capacitance: 10nF  [FP-CGA3E-0_3-0_1-IPC_A]  (hidden comment: CGA3E2X8R2A103K080AD)
C17  Capacitance: 10nF  [FP-CGA3E-0_3-0_1-IPC_A]  (hidden comment: CGA3E2X8R2A103K080AD)
R31  SchematicInformation: 10k  [R_0603]  (hidden comment: RES_10k_1%_0603)
R32  SchematicInformation: 10k  [R_0603]  (hidden comment: RES_10k_1%_0603)
R33  SchematicInformation: 1k  [R_0603]  (hidden comment: RES_1k_1%_0603)
R34  SchematicInformation: 10k  [R_0603]  (hidden comment: RES_10k_1%_0603)
R35  SchematicInformation: 10k  [R_0603]  (hidden comment: RES_10k_1%_0603)
R36  SchematicInformation: 1k  [R_0603]  (hidden comment: RES_1k_1%_0603)
R37  SchematicInformation: 10k  [R_0603]  (hidden comment: RES_10k_1%_0603)
R38  SchematicInformation: 10k  [R_0603]  (hidden comment: RES_10k_1%_0603)
R39  SchematicInformation: 1k  [R_0603]  (hidden comment: RES_1k_1%_0603)
U7  BTS50060-1TEA  [INF-PG-TO252-5_BTF50060_L]
U10  BTS50060-1TEA  [INF-PG-TO252-5_BTF50060_L]
U11  BTS50060-1TEA  [INF-PG-TO252-5_BTF50060_L]

### Ports
CHARGE_RELAY_CTL (out), CHARGE_RELAY_CURRENT (out), CHARGE_RELAY_SW_EN (in), NEGATIVE_RELAY_CTL (out), NEGATIVE_RELAY_CURRENT (out), NEGATIVE_RELAY_SW_EN (in), POSITIVE_RELAY_CTL (out), POSITIVE_RELAY_CURRENT (out), POSITIVE_RELAY_SW_EN (in)

### Nets
+12V_Crit: U7.5(VS) U10.5(VS) U11.5(VS)
MGND: C15.1 C16.1 C17.1 R33.1 R36.1 R39.1 U7.1(GND) U10.1(GND) U11.1(GND)
NetC15_2: C15.2 R31.2 U10.2(IN)
NetC16_2: C16.2 R34.2 U7.2(IN)
NetC17_2: C17.2 R37.2 U11.2(IN)
NetCH_LG_1: R31.1 ; port CHARGE_RELAY_SW_EN
NetD2_2: U10.6(OUT) ; port CHARGE_RELAY_CTL
NetD3_2: U7.6(OUT) ; port POSITIVE_RELAY_CTL
NetD4_2: U11.6(OUT) ; port NEGATIVE_RELAY_CTL
NetNEG_LOG_1: R37.1 ; port NEGATIVE_RELAY_SW_EN
NetPOS_LG_1: R34.1 ; port POSITIVE_RELAY_SW_EN
NetR32_1: R32.1 ; port CHARGE_RELAY_CURRENT
NetR32_2: R32.2 R33.2 U10.4(IS)
NetR35_1: R35.1 ; port POSITIVE_RELAY_CURRENT
NetR35_2: R35.2 R36.2 U7.4(IS)
NetR38_1: R38.1 ; port NEGATIVE_RELAY_CURRENT
NetR38_2: R38.2 R39.2 U11.4(IS)

### Notes on the sheet
- Relay Logic Input
- (near U10) Charge Relay Logic
- Relay Logic Output
- (near U7) Positive Relay Logic
- (near U11) Negative Relay Logic
- Switch Relays
- 8
- 9
- Jake Hafele

### Library data of the parts
C15-C17 = CMP-08246-000769-1: as C3 on sheet Connector_Exp; Mount: Surface Mount; Voltage Rating (DC): 100V; Termination: SMD/SMT; Dielectric: X8R; Case/Package: 0603; Ratings: AEC-Q200; Voltage Rating: 100V; Packaging: Tape and Reel; Thickness: 0.035inch; Composition: Ceramic; Max Operating Temperature: 150°C; Width: 0.031inch; Height: 0.8mm; Weight: 7.1E-05oz; Depth: 0.8mm; Min Operating Temperature: -55°C; Length: 1.6mm; Case Code (Metric): 1608; Tolerance: 10%; Package Quantity: 4000; Case Code (Imperial): 0603
R31 R32 R34 R35 R37 R38 = RES_10k_1%_0603: as R1 on sheet Interface_exp; DigiKey Part Number: 311-10.0KHRCT-ND
R33 R36 R39 = RES_1k_1%_0603: as R23 on sheet Connector_Exp; DigiKey Part Number: 311-1.00KHRCT-ND
U7 U10 U11 = CMP-1095-00101-1: High Current PROFET Smart High-Side Power Switch, 1 Channel, 16.5 A Load Current, -40 to 150 degC, PG-TO252-5-11, Reel, Green; Manufacturer: Infineon; ton (max): 130 us; Channels: 1; Recommended Operating Voltage Max.: 28 V; toff (max): 150 us; RON @ 25degreesC: 6 mOhm; Recommended Operating Voltage Min.: 4.7 V; Green: TRUE; RON(max) @ 150degreesC: 12 mOhm; Load Current (typ): 16.5 A; Group: Automotive Qualified; PackageDescription: 5-Pin Plastic (Green) Transistor Single Outline Package, 6.5 x 6.12 mm Body, 1.14 mm Pitch; PackageVersion: Sep-11; ComponentLink2Description: Datasheet; Mounting Technology: Surface Mount; ComponentLink2URL: http://www.infineon.com/dgdl/BTS50060-1TEA_DS_v12_2011-09-01.pdf?folderId=db3a304314dca389011537739e37155f&fileId=db3a30432ac1eb91012ad29559f104ad&location=en.Products.Automotive_ICs.Smart_High-_and_Low-Side_Switches.PROFET__-_Smart_High_Side_Switches.DATA; DatasheetVersion: Rev.1.2; PartNumber: BTS50060-1TEA; ComponentLink3URL: http://www.infineon.com/dgdl/BTF50060-1TEA_DS_v12_2011-09-01.pdf?folderId=db3a304314dca389011537739e37155f&fileId=db3a30432ad629a6012b0a94d88d3f2e&sId=db3a30433db6f09f013dc356c9f93bd9; Halogen-free: TRUE; PackageReference: PG-TO252-5-11; ComponentLink3Description: Package Specification; ComponentLink1Description: Manufacturer URL; ComponentLink1URL: http://www.infineon.com/; Packing: Reel

## Sheet Relay_Logic.SchDoc
size A
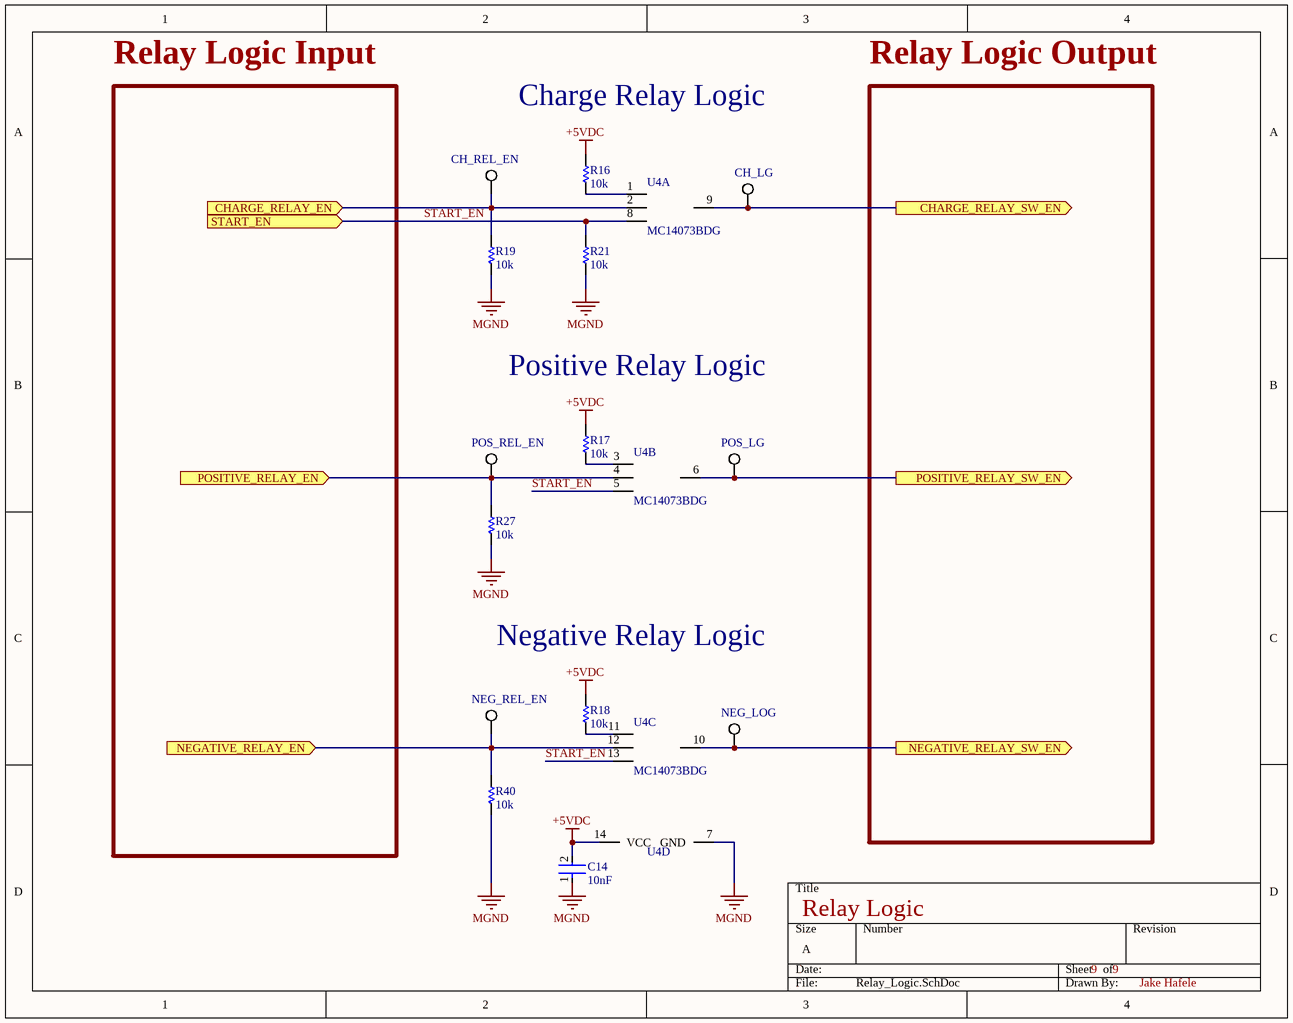
[diagram p7: Relay_Logic.SchDoc]

### Parts
C14  Capacitance: 10nF  [FP-CGA3E-0_3-0_1-IPC_A]  (hidden comment: CGA3E2X8R2A103K080AD)
CH_LG  Test Point  [Test Point]  (value not drawn)
CH_REL_EN  Test Point  [Test Point]  (value not drawn)
NEG_LOG  Test Point  [Test Point]  (value not drawn)
NEG_REL_EN  Test Point  [Test Point]  (value not drawn)
POS_LG  Test Point  [Test Point]  (value not drawn)
POS_REL_EN  Test Point  [Test Point]  (value not drawn)
R16  SchematicInformation: 10k  [R_0603]  (hidden comment: RES_10k_1%_0603)
R17  SchematicInformation: 10k  [R_0603]  (hidden comment: RES_10k_1%_0603)
R18  SchematicInformation: 10k  [R_0603]  (hidden comment: RES_10k_1%_0603)
R19  SchematicInformation: 10k  [R_0603]  (hidden comment: RES_10k_1%_0603)
R21  SchematicInformation: 10k  [R_0603]  (hidden comment: RES_10k_1%_0603)
R27  SchematicInformation: 10k  [R_0603]  (hidden comment: RES_10k_1%_0603)
R40  SchematicInformation: 10k  [R_0603]  (hidden comment: RES_10k_1%_0603)
U4  MC14073BDG  [SO14]  (parts A,B,C,D of 4)

### Ports
CHARGE_RELAY_EN (in), CHARGE_RELAY_SW_EN (out), NEGATIVE_RELAY_EN (in), NEGATIVE_RELAY_SW_EN (out), POSITIVE_RELAY_EN (in), POSITIVE_RELAY_SW_EN (out), START_EN (in)

### Nets
+5VDC: C14.2 R16.1 R17.1 R18.1 U4.14(VCC)
MGND: C14.1 R19.2 R21.2 R27.2 R40.2 U4.7(GND)
START_EN: R21.1 U4.5 U4.8 U4.13 ; port START_EN
NetCH_LG_1: CH_LG.1 U4.9 ; port CHARGE_RELAY_SW_EN
NetCH_REL_EN_1: CH_REL_EN.1 R19.1 U4.2 ; port CHARGE_RELAY_EN
NetNEG_LOG_1: NEG_LOG.1 U4.10 ; port NEGATIVE_RELAY_SW_EN
NetNEG_REL_EN_1: NEG_REL_EN.1 R40.1 U4.12 ; port NEGATIVE_RELAY_EN
NetPOS_LG_1: POS_LG.1 U4.6 ; port POSITIVE_RELAY_SW_EN
NetPOS_REL_EN_1: POS_REL_EN.1 R27.1 U4.4 ; port POSITIVE_RELAY_EN
NetR16_2: R16.2 U4.1
NetR17_2: R17.2 U4.3
NetR18_2: R18.2 U4.11

### Notes on the sheet
- Relay Logic Input
- Relay Logic Output
- Charge Relay Logic
- Positive Relay Logic
- Negative Relay Logic
- Relay Logic
- 9
- Jake Hafele

### Library data of the parts
C14 = CMP-08246-000769-1: as C3 on sheet Connector_Exp; Mount: Surface Mount; Voltage Rating (DC): 100V; Termination: SMD/SMT; Dielectric: X8R; Case/Package: 0603; Ratings: AEC-Q200; Voltage Rating: 100V; Packaging: Tape and Reel; Thickness: 0.035inch; Composition: Ceramic; Max Operating Temperature: 150°C; Width: 0.031inch; Height: 0.8mm; Weight: 7.1E-05oz; Depth: 0.8mm; Min Operating Temperature: -55°C; Length: 1.6mm; Case Code (Metric): 1608; Tolerance: 10%; Package Quantity: 4000; Case Code (Imperial): 0603
R16-R19 R21 R27 R40 = RES_10k_1%_0603: as R1 on sheet Interface_exp; DigiKey Part Number: 311-10.0KHRCT-ND
U4 = MC14073BDG: Triple 3-Input AND; ComponentLink1Description: Datasheet; ComponentLink1URL: http://www.onsemi.com/pub_link/Collateral/MC14001B-D.PDF; Drawn By: Aaron Mills; Drawing Date: Jan. 17, 2011

## Nets that join several sheets
+5VDC: Compute (U1.Vdd), Connector_Exp (J3.3), Interface_exp (14 pins), ModuleBoard_Interface (Q6.3 R12.2), Regulator (D5.2 R20.2), Relay_Logic (5 pins)
+12V_Crit: Connector_Exp (8 pins), Regulator (C11.2 U2.1 U2.2), Power_Switch (U7.5 U10.5 U11.5)
MGND: Compute (U1.GND), Connector_Exp (32 pins), Interface_exp (16 pins), ModuleBoard_Interface (R11.1), Regulator (6 pins), Power_Switch (9 pins), Relay_Logic (6 pins)
EXT_CHG_SW: Compute (U1.PA18), Interface_exp (Q3.3 R41.2 U5.8)
MCAN_H: Compute (U1.CANH), Connector_Exp (C8.1 J6.1 J8.1)
MCAN_L: Compute (U1.CANL), Connector_Exp (C12.1 J6.2 J8.2)
NetC4_1: Compute (U1.PA16), Connector_Exp (C4.1 J15.1), Interface_exp (U6.2), ModuleBoard_Interface (R12.1)
NetCH_LG_1: Power_Switch (R31.1), Relay_Logic (CH_LG.1 U4.9)
NetCH_REL_EN_1: Compute (U1.PA11), Relay_Logic (CH_REL_EN.1 R19.1 U4.2)
NetD2_2: Connector_Exp (D2.2 J2.2), Power_Switch (U10.6)
NetD3_2: Connector_Exp (D3.2 J4.2), Power_Switch (U7.6)
NetD4_2: Connector_Exp (D4.2 J5.2), Power_Switch (U11.6)
NetJ7_3: Compute (U1.PA03), Connector_Exp (J7.3)
NetJ9_3: Compute (U1.PA02), Connector_Exp (J9.3)
NetJ10_1: Connector_Exp (J10.1), Interface_exp (Q5.3 R9.1)
NetJ11_1: Compute (U1.PB04), Connector_Exp (J11.1)
NetJ12_3: Compute (U1.PA25), Connector_Exp (J12.3)
NetJ13_1: Connector_Exp (J13.1), ModuleBoard_Interface (R10.1)
NetJ14_1: Connector_Exp (J14.1), Interface_exp (Q2.1 R8.2)
NetJ14_2: Connector_Exp (J14.2), Interface_exp (Q3.1 R42.2)
NetJ14_3: Connector_Exp (J14.3), Interface_exp (Q1.3)
NetJ17_1: Connector_Exp (J17.1), Interface_exp (Q4.3 R4.1)
NetNEG_LOG_1: Power_Switch (R37.1), Relay_Logic (NEG_LOG.1 U4.10)
NetNEG_REL_EN_1: Compute (U1.PA10), Relay_Logic (NEG_REL_EN.1 R40.1 U4.12)
NetPOS_LG_1: Power_Switch (R34.1), Relay_Logic (POS_LG.1 U4.6)
NetPOS_REL_EN_1: Compute (U1.PA09), Relay_Logic (POS_REL_EN.1 R27.1 U4.4)
NetQ4_1: Compute (U1.PB10), Interface_exp (Q4.1 R14.2)
NetQ5_1: Compute (U1.PA27), Interface_exp (Q5.1 R15.2)
NetQ6_2: Compute (U1.PA14), Interface_exp (R3.1 U5.5), ModuleBoard_Interface (Q6.2 R11.2)
NetR1_1: Compute (U1.PA17), Interface_exp (R1.1 U5.2)
NetR2_1: Compute (U1.PA19), Interface_exp (R2.1 U5.12)
NetR5_1: Compute (U1.PA13), Interface_exp (R5.1 U5.1 U5.4 U5.11)
NetR32_1: Compute (U1.PB00), Power_Switch (R32.1)
NetR35_1: Compute (U1.PB01), Power_Switch (R35.1)
NetR38_1: Compute (U1.PB02), Power_Switch (R38.1)
START_EN: Interface_exp (START_EN.1 U5.6), Relay_Logic (R21.1 U4.5 U4.8 U4.13)